# EAGLE schematic flycopter_v1 (EAGLE 9.6.2)

## Sheet 1 of 4: PMS
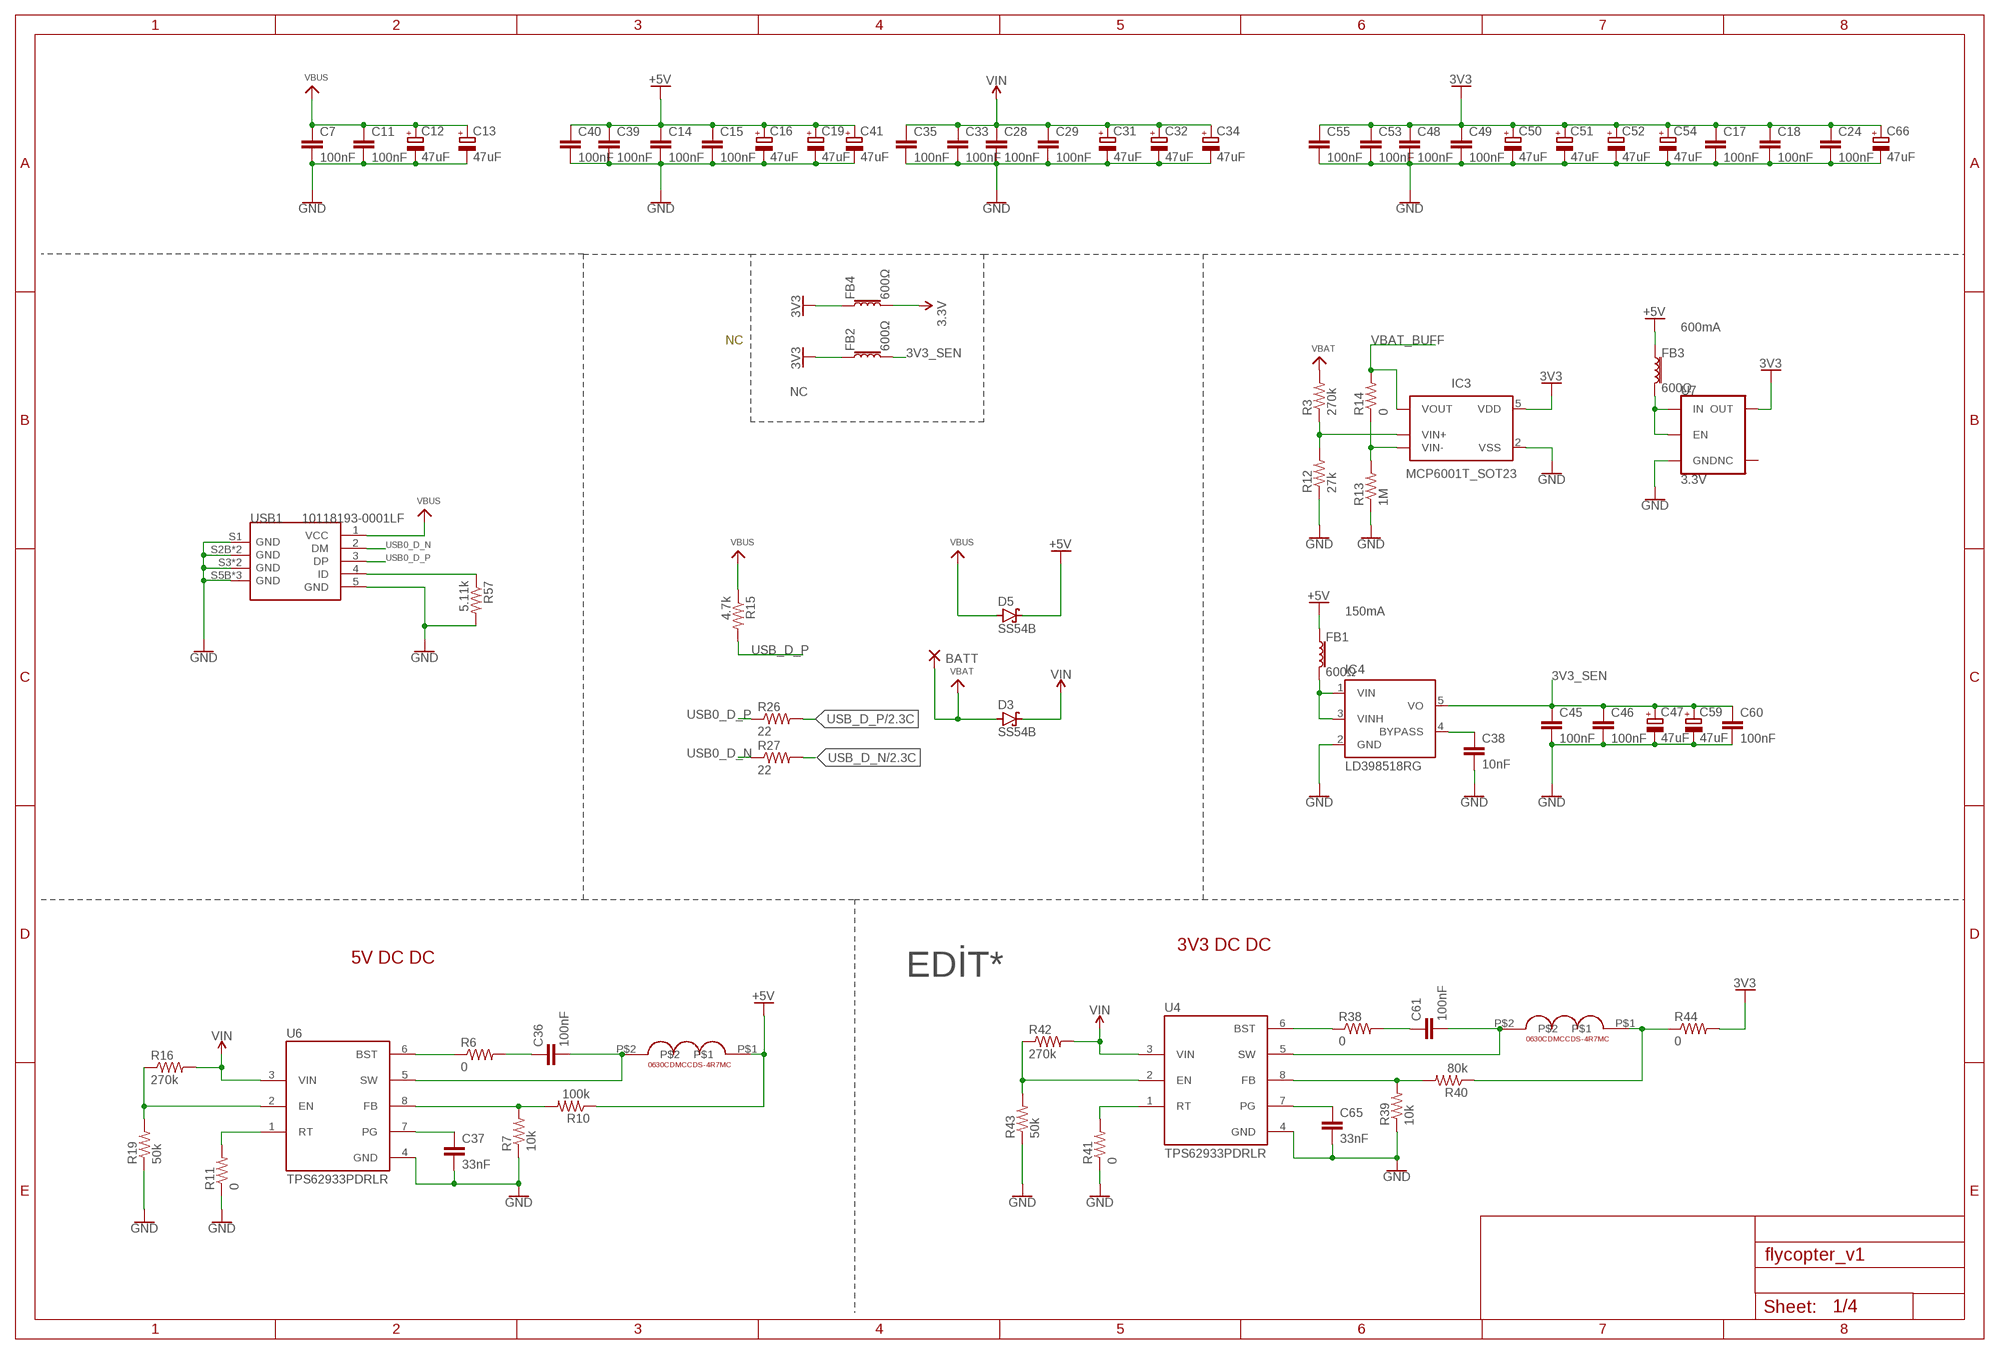
[diagram p0: schematic, sheet 1]

### Parts
BATT  SMD5  [SMD2,54-5,08]
C7  100nF  C-EUC0603K  [C0603K]
C11  100nF  C-EUC0603K  [C0603K]
C12  47uF  CPOL-EUA/3216-18R  [A/3216-18R]
C13  47uF  CPOL-EUA/3216-18R  [A/3216-18R]
C14  100nF  C-EUC0603K  [C0603K]
C15  100nF  C-EUC0603K  [C0603K]
C16  47uF  CPOL-EUA/3216-18R  [A/3216-18R]
C17  100nF  C-EUC0603K  [C0603K]
C18  100nF  C-EUC0603K  [C0603K]
C19  47uF  CPOL-EUA/3216-18R  [A/3216-18R]
C24  100nF  C-EUC0603K  [C0603K]
C28  100nF  C-EUC0603K  [C0603K]
C29  100nF  C-EUC0603K  [C0603K]
C31  47uF  CPOL-EUA/3216-18R  [A/3216-18R]
C32  47uF  CPOL-EUA/3216-18R  [A/3216-18R]
C33  100nF  C-EUC0603K  [C0603K]
C34  47uF  CPOL-EUA/3216-18R  [A/3216-18R]
C35  100nF  C-EUC0603K  [C0603K]
C36  100nF  C-EUC0603K  [C0603K]
C37  33nF  C-EUC0603K  [C0603K]
C38  10nF  C-EUC0603K  [C0603K]
C39  100nF  C-EUC0603K  [C0603K]
C40  100nF  C-EUC0603K  [C0603K]
C41  47uF  CPOL-EUA/3216-18R  [A/3216-18R]
C45  100nF  C-EUC0603K  [C0603K]
C46  100nF  C-EUC0603K  [C0603K]
C47  47uF  CPOL-EUA/3216-18R  [A/3216-18R]
C48  100nF  C-EUC0603K  [C0603K]
C49  100nF  C-EUC0603K  [C0603K]
C50  47uF  CPOL-EUA/3216-18R  [A/3216-18R]
C51  47uF  CPOL-EUA/3216-18R  [A/3216-18R]
C52  47uF  CPOL-EUA/3216-18R  [A/3216-18R]
C53  100nF  C-EUC0603K  [C0603K]
C54  47uF  CPOL-EUA/3216-18R  [A/3216-18R]
C55  100nF  C-EUC0603K  [C0603K]
C59  47uF  CPOL-EUA/3216-18R  [A/3216-18R]
C60  100nF  C-EUC0603K  [C0603K]
C61  100nF  C-EUC0603K  [C0603K]
C65  33nF  C-EUC0603K  [C0603K]
C66  47uF  CPOL-EUA/3216-18R  [A/3216-18R]
D3  SS54B  [SMB]
D5  SS54B  [SMB]
FB1  600Ω  FERRITE_BEAD-0805-600Ω-100MHZ  [0805]
FB2  600Ω  FERRITE_BEAD-0805-600Ω-100MHZ  [0805]
FB3  600Ω  FERRITE_BEAD-0805-600Ω-100MHZ  [0805]
FB4  600Ω  FERRITE_BEAD-0805-600Ω-100MHZ  [0805]
IC3  MCP6001T_SOT23  [SOT95P280X145-5N]
IC4  LD398518RG  [TSOT23-5L]
R3  270k  R-US_R0402  [R0402]
R6  0  R-US_R0402  [R0402]
R7  10k  R-US_R0402  [R0402]
R10  100k  R-US_R0402  [R0402]
R11  0  R-US_R0402  [R0402]
R12  27k  R-US_R0402  [R0402]
R13  1M  R-US_R0402  [R0402]
R14  0  R-US_R0402  [R0402]
R15  4.7k  R-US_R0402  [R0402]
R16  270k  R-US_R0402  [R0402]
R19  50k  R-US_R0402  [R0402]
R26  22  R-US_R0402  [R0402]
R27  22  R-US_R0402  [R0402]
R38  0  R-US_R0402  [R0402]
R39  10k  R-US_R0402  [R0402]
R40  80k  R-US_R0402  [R0402]
R41  0  R-US_R0402  [R0402]
R42  270k  R-US_R0402  [R0402]
R43  50k  R-US_R0402  [R0402]
R44  0  R-US_M0805  [M0805]
R57  5.11k  R-US_R0402  [R0402]
U4  TPS62933PDRLR  [SOFL50P160X60-8N]
U6  TPS62933PDRLR  [SOFL50P160X60-8N]
U7  3.3V  V_REG_AP2112K-3.3V  [SOT23-5]
U$5  6.8uH  0630CDMCCDS-4R7MC  [0630CDMCCDS-4R7MC]
U$9  4.7uH  0630CDMCCDS-4R7MC  [0630CDMCCDS-4R7MC]
USB1  10118193-0001LF  MICRO-USB-SMD-B-(10118193-0001LF)  [MICRO-USB5+6P-SMD-0.65-B]

### Nets
3.3V [power]: FB4.2 ; also sheet 4
3V3 [power]: C17.1 C18.1 C24.1 C48.1 C49.1 C50.+ C51.+ C52.+ C53.1 C54.+ C55.1 C66.+ FB2.1 FB4.1 IC3.5(VDD) R44.2 U7.5(OUT) ; also sheet 2,3
3V3_SEN [power]: C45.1 C46.1 C47.+ C59.+ C60.1 FB2.2 IC4.5(VO) ; also sheet 3
+5V [power]: C14.1 C15.1 C16.+ C19.+ C39.1 C40.1 C41.+ D5.C FB1.1 FB3.1 R10.1 U$5.P$1 ; also sheet 3
GND [power]: C7.2 C11.2 C12.- C13.- C14.2 C15.2 C16.- C17.2 C18.2 C19.- C24.2 C28.2 C29.2 C31.- C32.- C33.2 C34.- C35.2 C37.2 C38.2 C39.2 C40.2 C41.- C45.2 C46.2 C47.- C48.2 C49.2 C50.- C51.- C52.- C53.2 C54.- C55.2 C59.- C60.2 C65.2 C66.- IC3.2(VSS) IC4.2(GND) R7.1 R11.1 R12.1 R13.1 R19.1 R39.1 R41.1 R43.1 R57.2 U4.4(GND) U6.4(GND) U7.2(GND) USB1.5(GND) USB1.S1(GND) USB1.S2B(GND) USB1.S2T(GND) USB1.S3(GND) USB1.S4(GND) USB1.S5B(GND) USB1.S5T(GND) USB1.S6(GND) ; also sheet 2,3,4
N$1: C36.2 U6.5(SW) U$5.P$2
N$4: C36.1 R6.2
N$5: R6.1 U6.6(BST)
N$6: R7.2 R10.2 U6.8(FB)
N$7: C37.1 U6.7(PG)
N$8: R16.1 R19.2 U6.2(EN)
N$9: R11.2 U6.1(RT)
N$10: FB1.2 IC4.1(VIN) IC4.3(VINH)
N$11: C38.1 IC4.4(BYPASS)
N$12: FB3.2 U7.1(IN) U7.3(EN)
N$13: IC3.4(VIN-) R13.2 R14.1
N$14: IC3.3(VIN+) R3.1 R12.2
N$15: C61.2 U4.5(SW) U$9.P$2
N$18: R57.1 USB1.4(ID)
N$52: C61.1 R38.2
N$54: R38.1 U4.6(BST)
N$57: R39.2 R40.2 U4.8(FB)
N$63: C65.1 U4.7(PG)
N$64: R41.2 U4.1(RT)
N$65: R42.1 R43.2 U4.2(EN)
N$66: R40.1 R44.1 U$9.P$1
USB0_D_N [USB]: R27.1 USB1.2(DM)
USB0_D_P [USB]: R26.1 USB1.3(DP)
USB_D_N [USB]: R27.2 ; also sheet 2
USB_D_P [USB]: R15.2 R26.2 ; also sheet 2
VBAT [power]: BATT.1(P) D3.A R3.2
VBAT_BUFF: IC3.1(VOUT) R14.2 ; also sheet 2
VBUS: C7.1 C11.1 C12.+ C13.+ D5.A R15.1 USB1.1(VCC)
VIN [power]: C28.1 C29.1 C31.+ C32.+ C33.1 C34.+ C35.1 D3.C R16.2 R42.2 U4.3(VIN) U6.3(VIN)
Unconnected: U7.4(NC)

### Notes on the sheet
- 600mA
- NC
- NC
- 150mA
- 3V3 DC DC
- 5V DC DC
- EDİT*

## Sheet 2 of 4: MCU
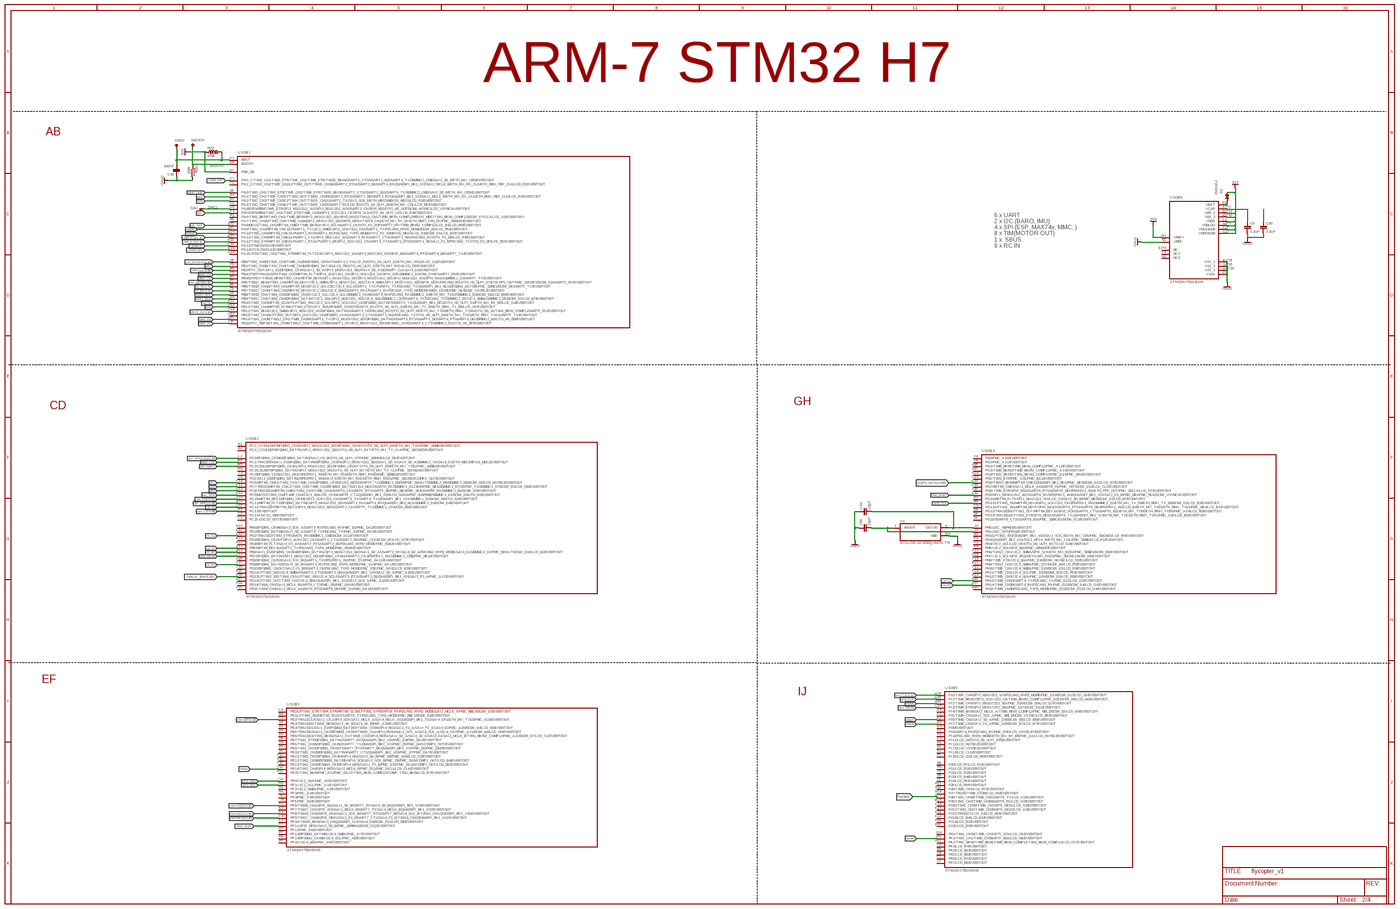
[diagram p1: schematic, sheet 2, overview]
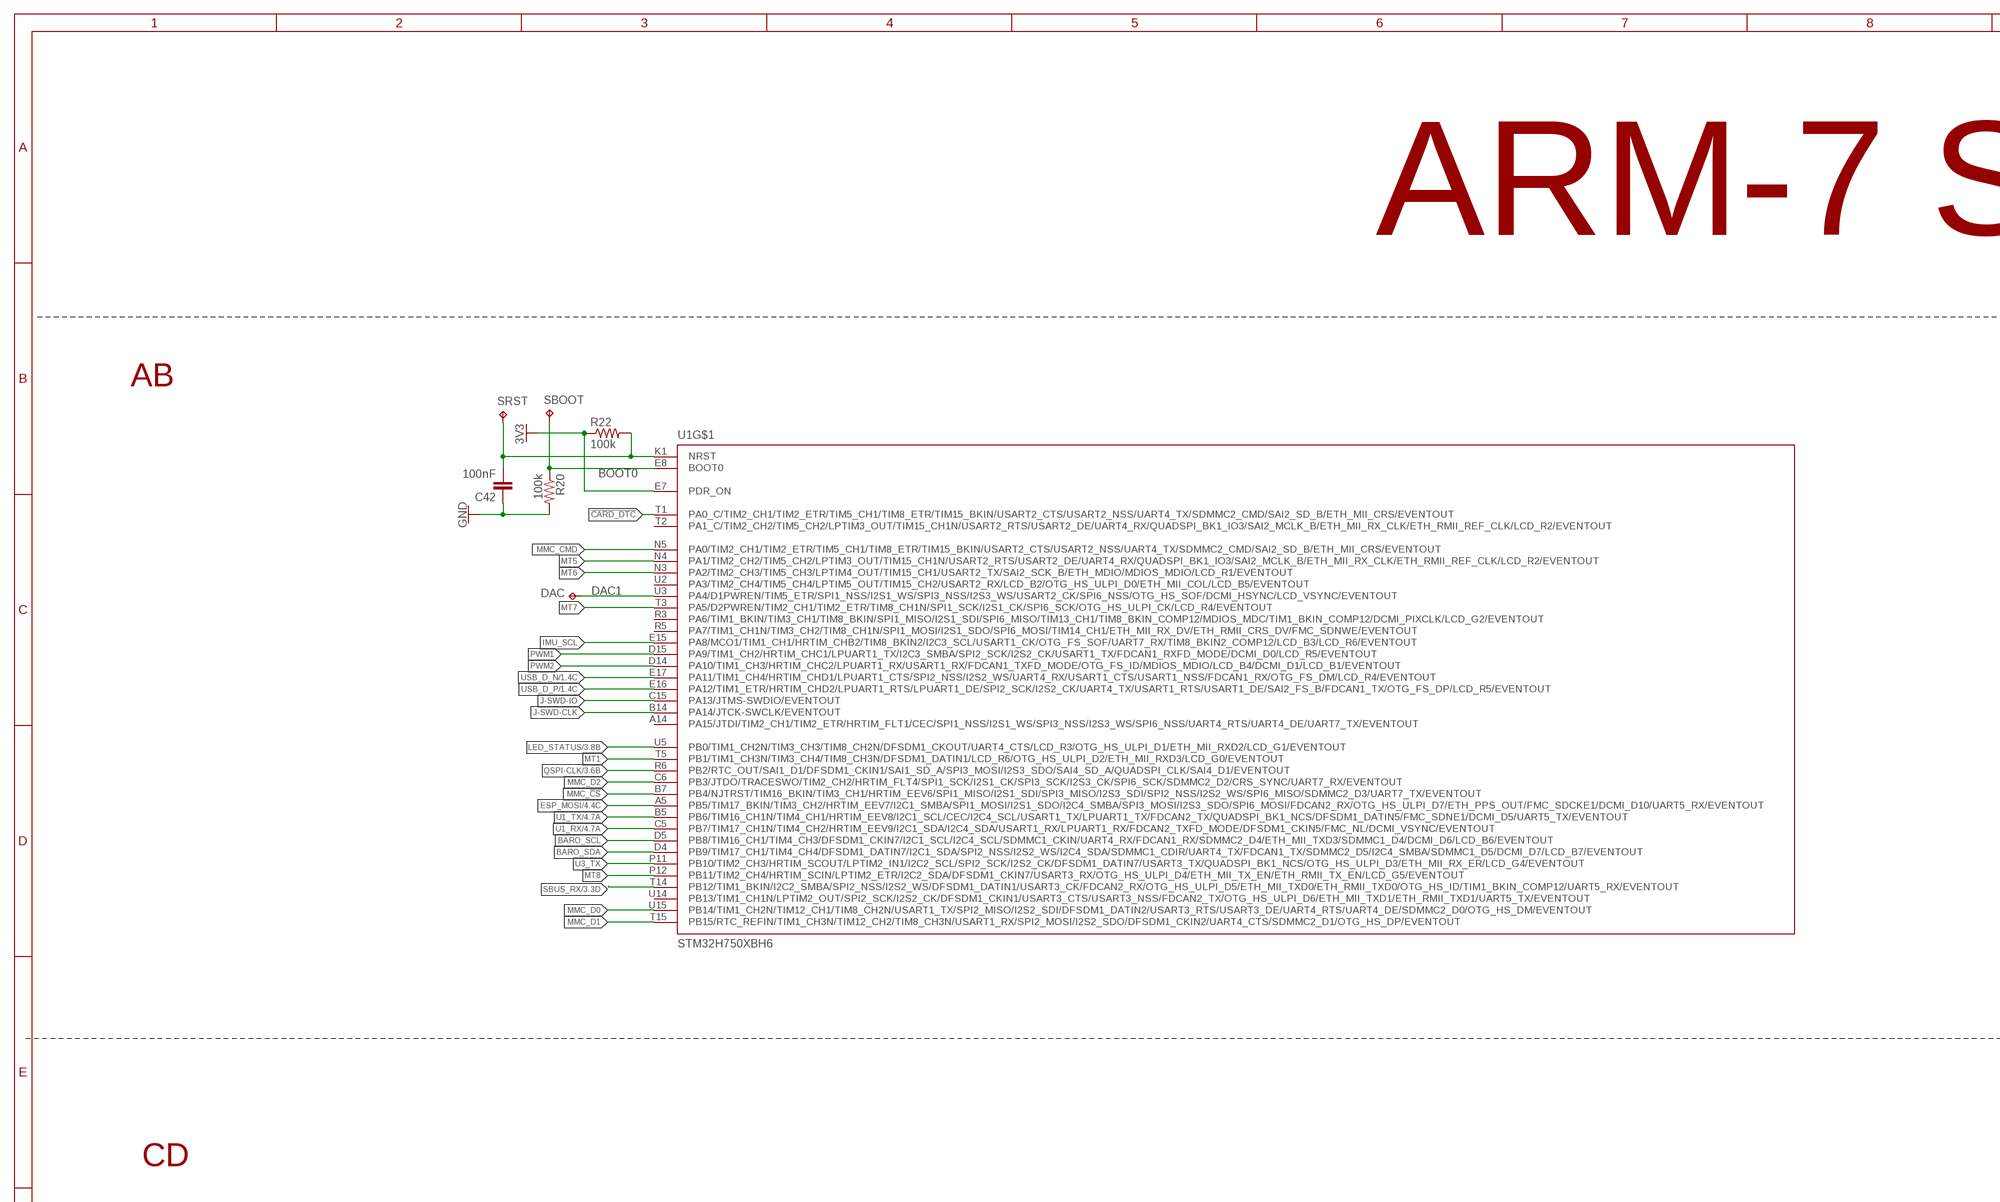
[diagram p2: schematic, sheet 2, part 1 of 4]
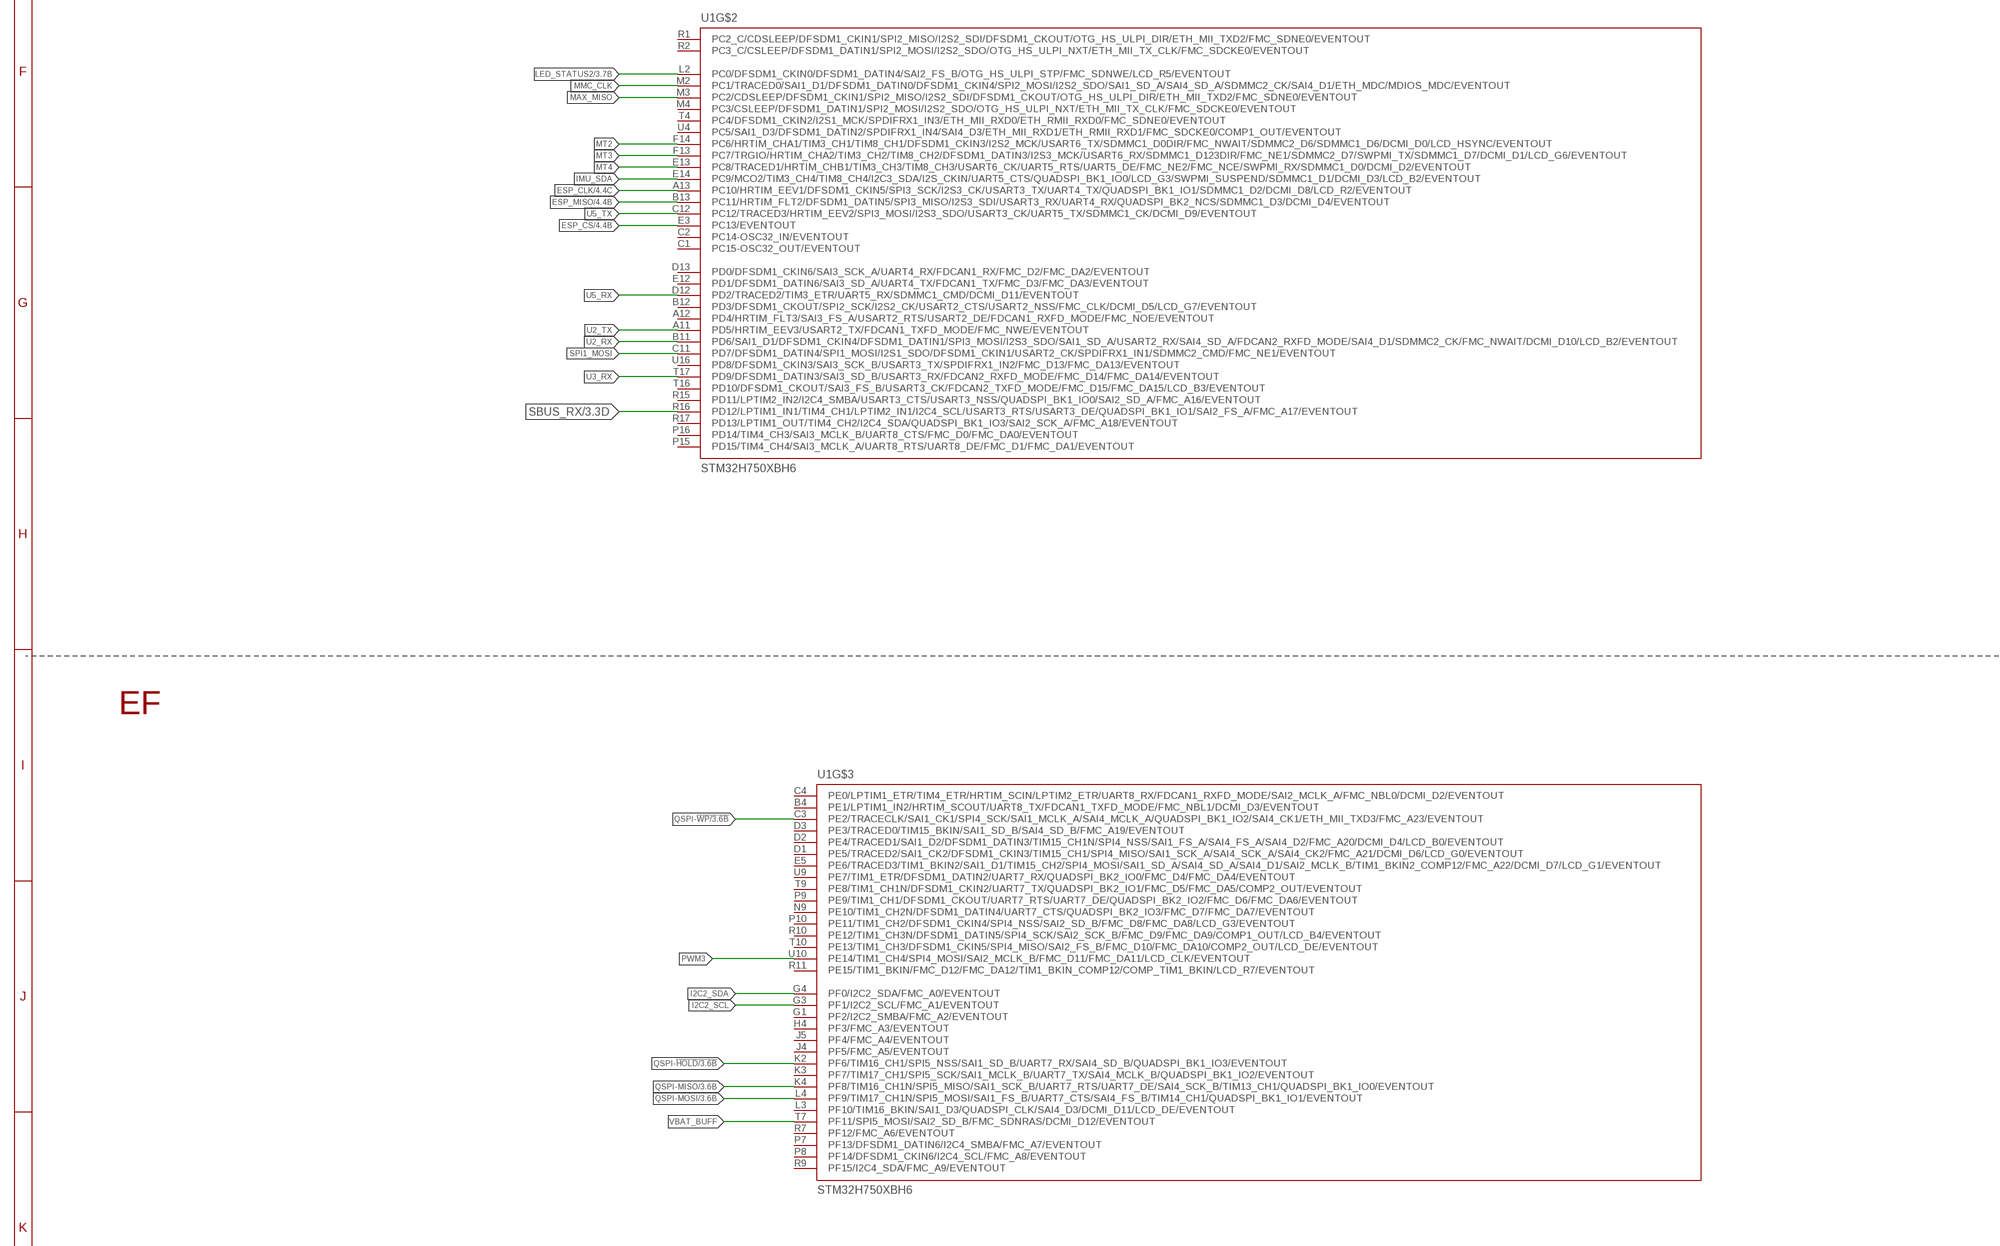
[diagram p3: schematic, sheet 2, part 2 of 4]
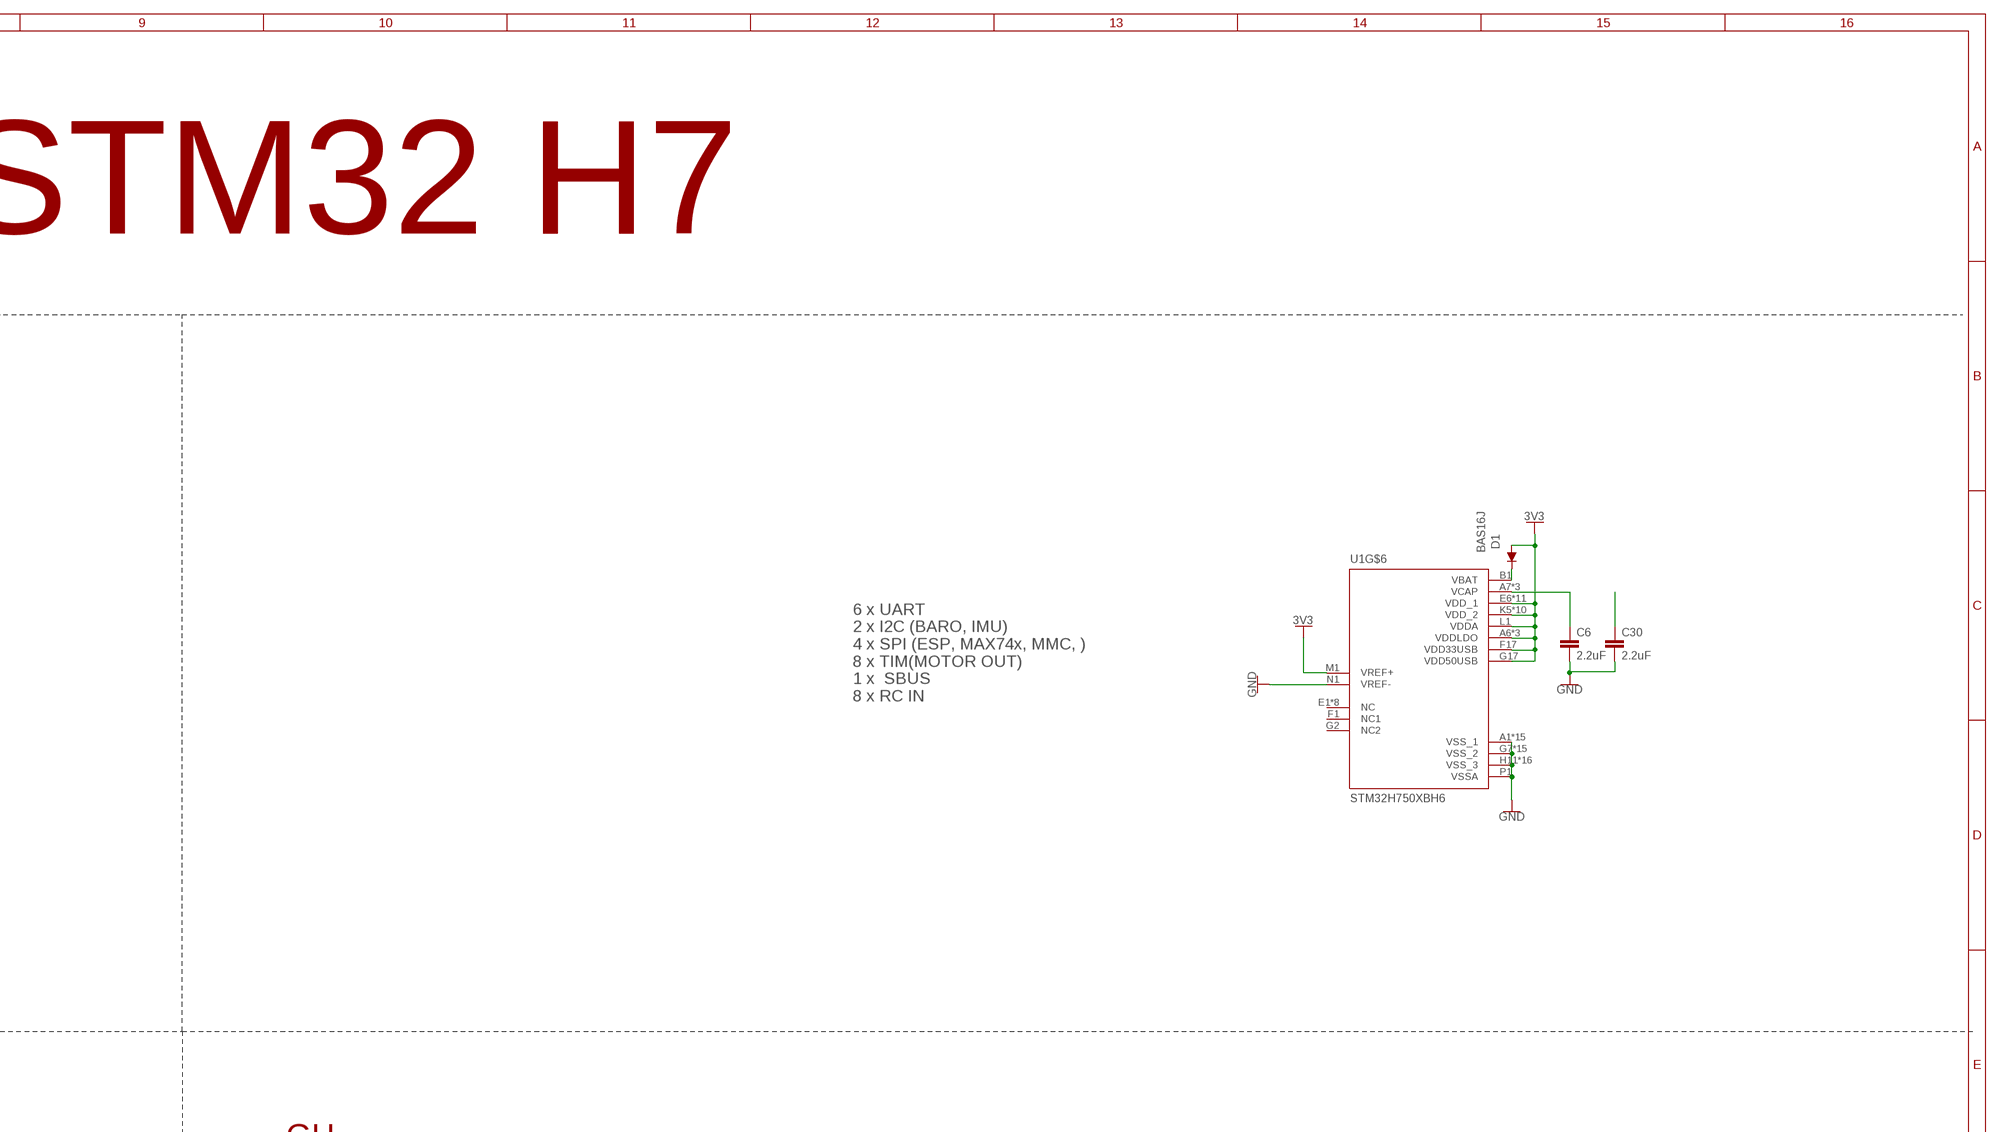
[diagram p4: schematic, sheet 2, part 3 of 4]
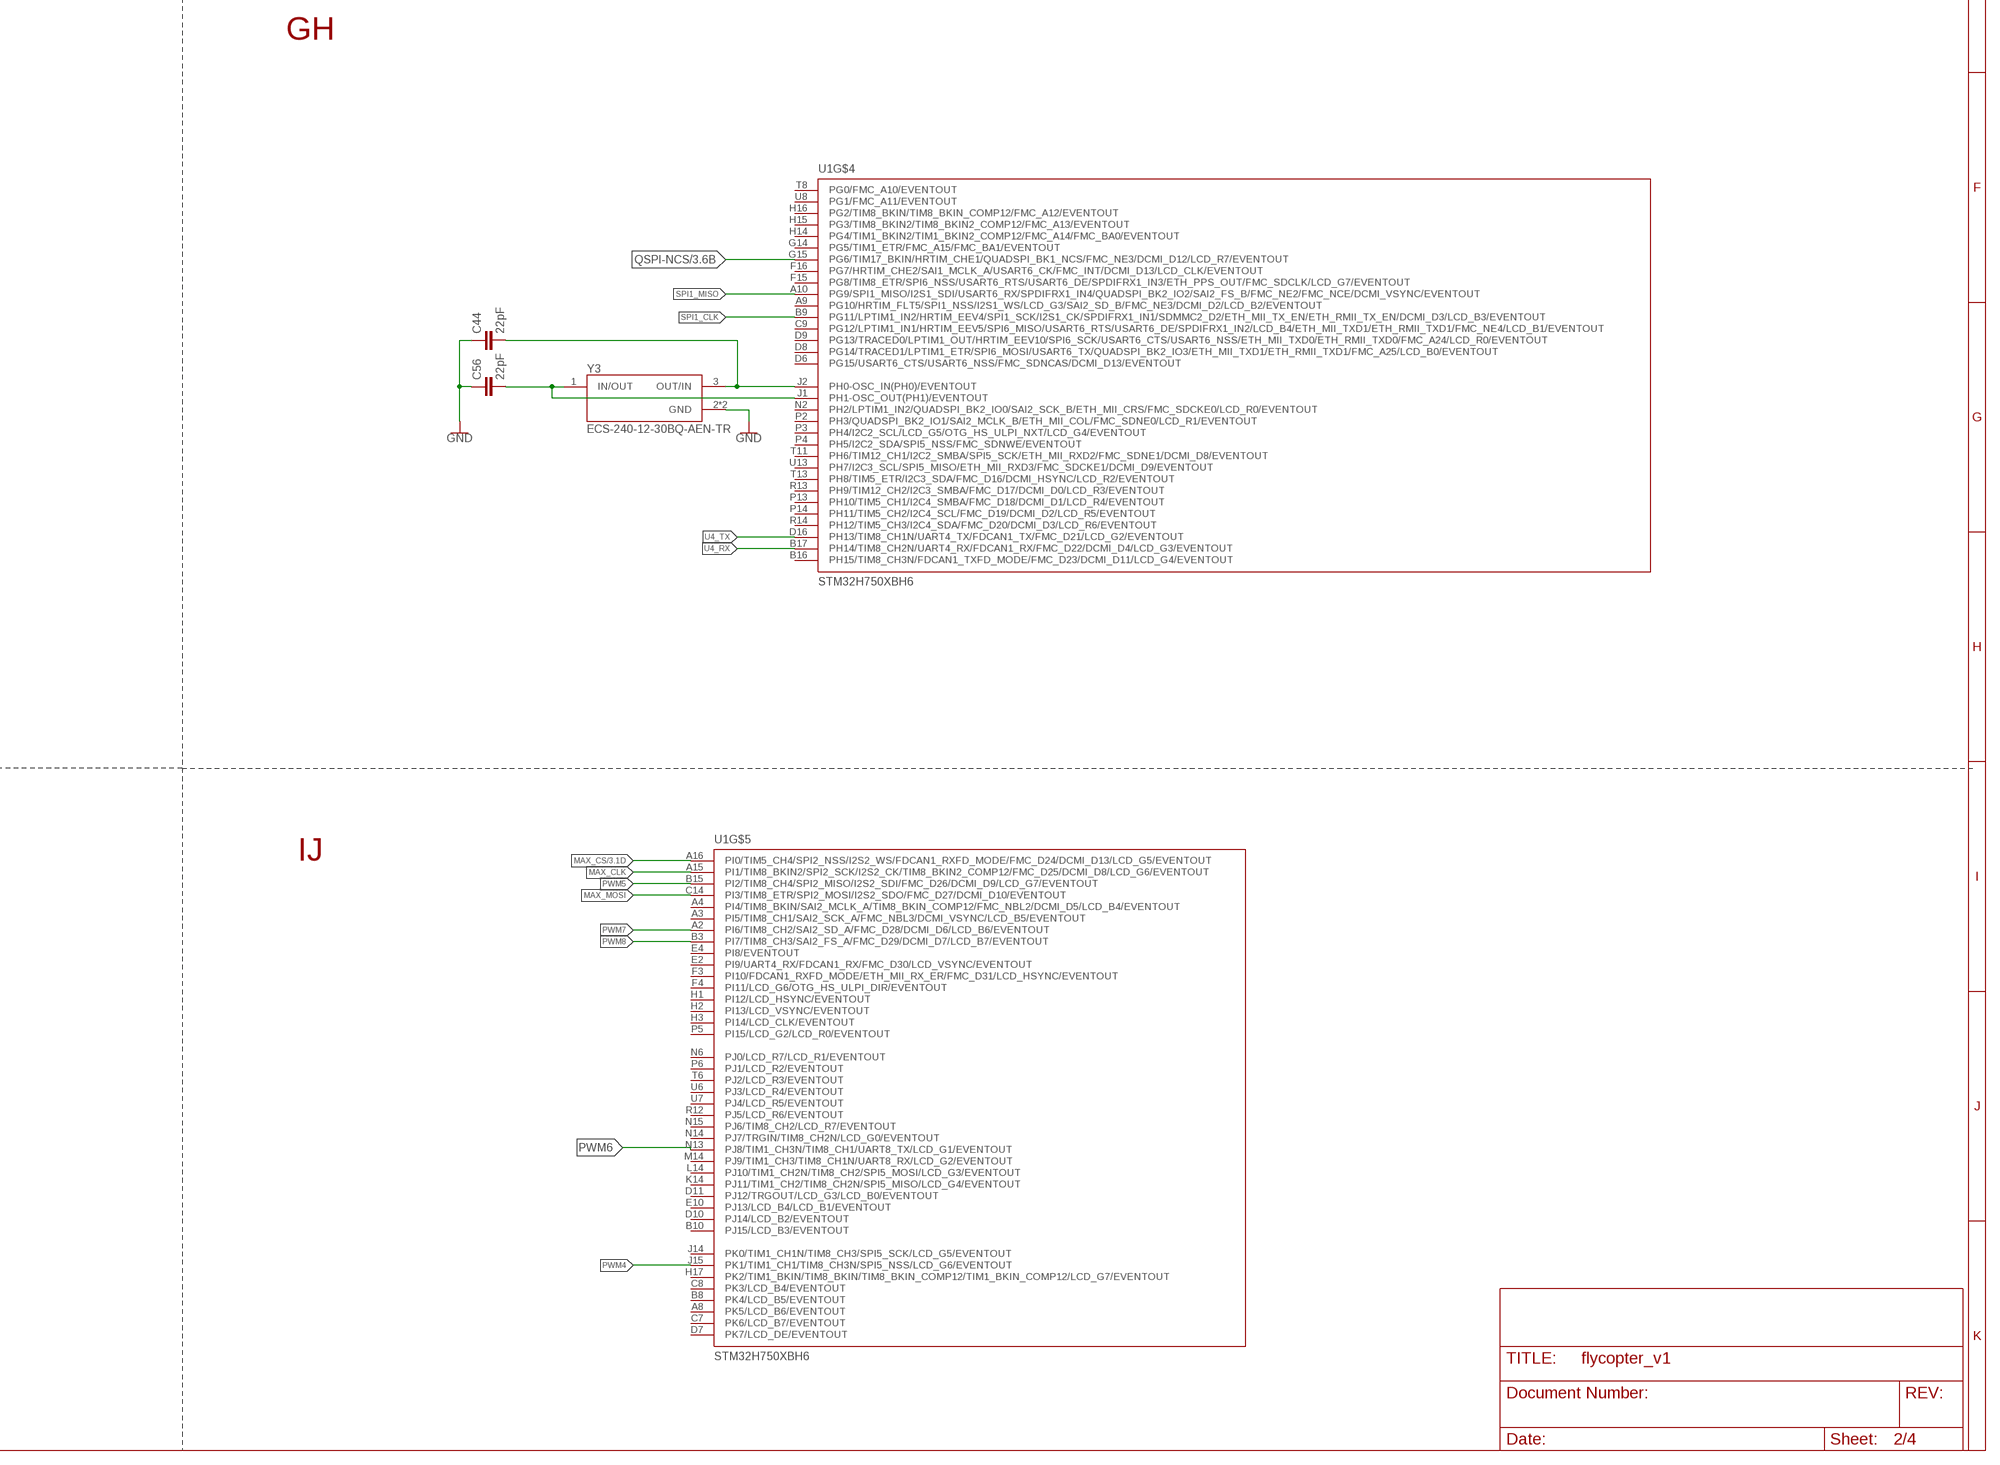
[diagram p5: schematic, sheet 2, part 4 of 4]

### Parts
C6  2.2uF  C-EUC0603K  [C0603K]
C30  2.2uF  C-EUC0603K  [C0603K]
C42  100nF  C-EUC0603K  [C0603K]
C44  22pF  C-EUC0402K  [C0402K]
C56  22pF  C-EUC0402K  [C0402K]
D1  BAS16J  DIODE_DIODE-SOD123  [DIODE_SOD123]
DAC  TPTP06R  [TP06R]
R20  100k  R-US_R0402  [R0402]
R22  100k  R-US_R0402  [R0402]
SBOOT  TPTP06R  [TP06R]
SRST  TPTP06R  [TP06R]
U1  STM32H750XBH6  [IC_STM32H750XBH6]
Y3  ECS-240-12-30BQ-AEN-TR  [XTAL_ECS-240-12-30BQ-AEN-TR]

### Nets
3V3 [power]: D1.A R22.1 U1.A6(VDDLDO) U1.C17(VDDLDO) U1.E6(VDD_1) U1.E7(PDR_ON) U1.E9(VDD_1) U1.E11(VDD_1) U1.F5(VDD_1) U1.F17(VDD33USB) U1.G5(VDD_1) U1.G13(VDD_1) U1.G17(VDD50USB) U1.H5(VDD_1) U1.H13(VDD_1) U1.J13(VDD_1) U1.K5(VDD_2) U1.K13(VDD_1) U1.L1(VDDA) U1.L5(VDD_2) U1.L13(VDD_1) U1.M1(VREF+) U1.M5(VDD_2) U1.M13(VDD_2) U1.N7(VDD_2) U1.N8(VDD_2) U1.N10(VDD_2) U1.N11(VDD_2) U1.N12(VDD_2) U1.P17(VDD_2) U1.U12(VDDLDO) ; also sheet 1,3
!CARD_DTC: U1.T1(PA0_C/TIM2_CH1/TIM2_ETR/TIM5_CH1/TIM8_ETR/TIM15_BKIN/USART2_CTS/USART2_NSS/UART4_TX/SDMMC2_CMD/SAI2_SD_B/ETH_MII_CRS/EVENTOUT) ; also sheet 3
BARO_SCL: U1.D5(PB8/TIM16_CH1/TIM4_CH3/DFSDM1_CKIN7/I2C1_SCL/I2C4_SCL/SDMMC1_CKIN/UART4_RX/FDCAN1_RX/SDMMC2_D4/ETH_MII_TXD3/SDMMC1_D4/DCMI_D6/LCD_B6/EVENTOUT) ; also sheet 3
BARO_SDA: U1.D4(PB9/TIM17_CH1/TIM4_CH4/DFSDM1_DATIN7/I2C1_SDA/SPI2_NSS/I2S2_WS/I2C4_SDA/SDMMC1_CDIR/UART4_TX/FDCAN1_TX/SDMMC2_D5/I2C4_SMBA/SDMMC1_D5/DCMI_D7/LCD_B7/EVENTOUT) ; also sheet 3
BOOT0: R20.1 SBOOT.TP U1.E8(BOOT0)
DAC1: DAC.TP U1.U3(PA4/D1PWREN/TIM5_ETR/SPI1_NSS/I2S1_WS/SPI3_NSS/I2S3_WS/USART2_CK/SPI6_NSS/OTG_HS_SOF/DCMI_HSYNC/LCD_VSYNC/EVENTOUT)
ESP_CLK: U1.A13(PC10/HRTIM_EEV1/DFSDM1_CKIN5/SPI3_SCK/I2S3_CK/USART3_TX/UART4_TX/QUADSPI_BK1_IO1/SDMMC1_D2/DCMI_D8/LCD_R2/EVENTOUT) ; also sheet 4
ESP_CS: U1.E3(PC13/EVENTOUT) ; also sheet 4
ESP_MISO: U1.B13(PC11/HRTIM_FLT2/DFSDM1_DATIN5/SPI3_MISO/I2S3_SDI/USART3_RX/UART4_RX/QUADSPI_BK2_NCS/SDMMC1_D3/DCMI_D4/EVENTOUT) ; also sheet 4
ESP_MOSI: U1.A5(PB5/TIM17_BKIN/TIM3_CH2/HRTIM_EEV7/I2C1_SMBA/SPI1_MOSI/I2S1_SDO/I2C4_SMBA/SPI3_MOSI/I2S3_SDO/SPI6_MOSI/FDCAN2_RX/OTG_HS_ULPI_D7/ETH_PPS_OUT/FMC_SDCKE1/DCMI_D10/UART5_RX/EVENTOUT) ; also sheet 4
GND [power]: C6.2 C30.2 C42.1 C44.1 C56.1 R20.2 U1.A1(VSS_1) U1.A17(VSS_1) U1.B2(VSS_1) U1.B6(VSS_1) U1.C10(VSS_1) U1.C13(VSS_1) U1.C16(VSS_1) U1.F2(VSS_1) U1.G7(VSS_2) U1.G8(VSS_2) U1.G9(VSS_2) U1.G10(VSS_2) U1.G11(VSS_2) U1.G16(VSS_2) U1.H7(VSS_2) U1.H8(VSS_2) U1.H9(VSS_2) U1.H10(VSS_2) U1.H11(VSS_3) U1.J3(VSS_1) U1.J7(VSS_3) U1.J8(VSS_3) U1.J9(VSS_3) U1.J10(VSS_3) U1.J11(VSS_3) U1.J16(VSS_1) U1.J17(VSS_1) U1.K7(VSS_3) U1.K8(VSS_3) U1.K9(VSS_3) U1.K10(VSS_3) U1.K11(VSS_3) U1.K15(VSS_2) U1.L7(VSS_3) U1.L8(VSS_3) U1.L9(VSS_3) U1.L10(VSS_3) U1.L11(VSS_3) U1.L15(VSS_2) U1.M15(VSS_2) U1.N1(VREF-) U1.N16(VSS_1) U1.P1(VSSA) U1.R4(VSS_1) U1.R8(VSS_2) U1.T12(VSS_1) U1.U1(VSS_2) U1.U17(VSS_1) Y3.2(GND) Y3.4(GND) ; also sheet 1,3,4
I2C2_SCL: U1.G3(PF1/I2C2_SCL/FMC_A1/EVENTOUT) ; also sheet 3
I2C2_SDA: U1.G4(PF0/I2C2_SDA/FMC_A0/EVENTOUT) ; also sheet 3
IMU_SCL: U1.E15(PA8/MCO1/TIM1_CH1/HRTIM_CHB2/TIM8_BKIN2/I2C3_SCL/USART1_CK/OTG_FS_SOF/UART7_RX/TIM8_BKIN2_COMP12/LCD_B3/LCD_R6/EVENTOUT) ; also sheet 3
IMU_SDA: U1.E14(PC9/MCO2/TIM3_CH4/TIM8_CH4/I2C3_SDA/I2S_CKIN/UART5_CTS/QUADSPI_BK1_IO0/LCD_G3/SWPMI_SUSPEND/SDMMC1_D1/DCMI_D3/LCD_B2/EVENTOUT) ; also sheet 3
J-SWD-CLK: U1.B14(PA14/JTCK-SWCLK/EVENTOUT) ; also sheet 3
J-SWD-IO: U1.C15(PA13/JTMS-SWDIO/EVENTOUT) ; also sheet 3
LED_STATUS: U1.U5(PB0/TIM1_CH2N/TIM3_CH3/TIM8_CH2N/DFSDM1_CKOUT/UART4_CTS/LCD_R3/OTG_HS_ULPI_D1/ETH_MII_RXD2/LCD_G1/EVENTOUT) ; also sheet 3
LED_STATUS2: U1.L2(PC0/DFSDM1_CKIN0/DFSDM1_DATIN4/SAI2_FS_B/OTG_HS_ULPI_STP/FMC_SDNWE/LCD_R5/EVENTOUT) ; also sheet 3
MAX_CLK: U1.A15(PI1/TIM8_BKIN2/SPI2_SCK/I2S2_CK/TIM8_BKIN2_COMP12/FMC_D25/DCMI_D8/LCD_G6/EVENTOUT) ; also sheet 3
MAX_CS: U1.A16(PI0/TIM5_CH4/SPI2_NSS/I2S2_WS/FDCAN1_RXFD_MODE/FMC_D24/DCMI_D13/LCD_G5/EVENTOUT) ; also sheet 3
MAX_MISO: U1.M3(PC2/CDSLEEP/DFSDM1_CKIN1/SPI2_MISO/I2S2_SDI/DFSDM1_CKOUT/OTG_HS_ULPI_DIR/ETH_MII_TXD2/FMC_SDNE0/EVENTOUT) ; also sheet 3
MAX_MOSI: U1.C14(PI3/TIM8_ETR/SPI2_MOSI/I2S2_SDO/FMC_D27/DCMI_D10/EVENTOUT) ; also sheet 3
MMC_!CS: U1.B7(PB4/NJTRST/TIM16_BKIN/TIM3_CH1/HRTIM_EEV6/SPI1_MISO/I2S1_SDI/SPI3_MISO/I2S3_SDI/SPI2_NSS/I2S2_WS/SPI6_MISO/SDMMC2_D3/UART7_TX/EVENTOUT) ; also sheet 3
MMC_CLK: U1.M2(PC1/TRACED0/SAI1_D1/DFSDM1_DATIN0/DFSDM1_CKIN4/SPI2_MOSI/I2S2_SDO/SAI1_SD_A/SAI4_SD_A/SDMMC2_CK/SAI4_D1/ETH_MDC/MDIOS_MDC/EVENTOUT) ; also sheet 3
MMC_CMD: U1.N5(PA0/TIM2_CH1/TIM2_ETR/TIM5_CH1/TIM8_ETR/TIM15_BKIN/USART2_CTS/USART2_NSS/UART4_TX/SDMMC2_CMD/SAI2_SD_B/ETH_MII_CRS/EVENTOUT) ; also sheet 3
MMC_D0: U1.U15(PB14/TIM1_CH2N/TIM12_CH1/TIM8_CH2N/USART1_TX/SPI2_MISO/I2S2_SDI/DFSDM1_DATIN2/USART3_RTS/USART3_DE/UART4_RTS/UART4_DE/SDMMC2_D0/OTG_HS_DM/EVENTOUT) ; also sheet 3
MMC_D1: U1.T15(PB15/RTC_REFIN/TIM1_CH3N/TIM12_CH2/TIM8_CH3N/USART1_RX/SPI2_MOSI/I2S2_SDO/DFSDM1_CKIN2/UART4_CTS/SDMMC2_D1/OTG_HS_DP/EVENTOUT) ; also sheet 3
MMC_D2: U1.C6(PB3/JTDO/TRACESWO/TIM2_CH2/HRTIM_FLT4/SPI1_SCK/I2S1_CK/SPI3_SCK/I2S3_CK/SPI6_SCK/SDMMC2_D2/CRS_SYNC/UART7_RX/EVENTOUT) ; also sheet 3
MT1: U1.T5(PB1/TIM1_CH3N/TIM3_CH4/TIM8_CH3N/DFSDM1_DATIN1/LCD_R6/OTG_HS_ULPI_D2/ETH_MII_RXD3/LCD_G0/EVENTOUT) ; also sheet 3
MT2: U1.F14(PC6/HRTIM_CHA1/TIM3_CH1/TIM8_CH1/DFSDM1_CKIN3/I2S2_MCK/USART6_TX/SDMMC1_D0DIR/FMC_NWAIT/SDMMC2_D6/SDMMC1_D6/DCMI_D0/LCD_HSYNC/EVENTOUT) ; also sheet 3
MT3: U1.F13(PC7/TRGIO/HRTIM_CHA2/TIM3_CH2/TIM8_CH2/DFSDM1_DATIN3/I2S3_MCK/USART6_RX/SDMMC1_D123DIR/FMC_NE1/SDMMC2_D7/SWPMI_TX/SDMMC1_D7/DCMI_D1/LCD_G6/EVENTOUT) ; also sheet 3
MT4: U1.E13(PC8/TRACED1/HRTIM_CHB1/TIM3_CH3/TIM8_CH3/USART6_CK/UART5_RTS/UART5_DE/FMC_NE2/FMC_NCE/SWPMI_RX/SDMMC1_D0/DCMI_D2/EVENTOUT) ; also sheet 3
MT5: U1.N4(PA1/TIM2_CH2/TIM5_CH2/LPTIM3_OUT/TIM15_CH1N/USART2_RTS/USART2_DE/UART4_RX/QUADSPI_BK1_IO3/SAI2_MCLK_B/ETH_MII_RX_CLK/ETH_RMII_REF_CLK/LCD_R2/EVENTOUT) ; also sheet 3
MT6: U1.N3(PA2/TIM2_CH3/TIM5_CH3/LPTIM4_OUT/TIM15_CH1/USART2_TX/SAI2_SCK_B/ETH_MDIO/MDIOS_MDIO/LCD_R1/EVENTOUT) ; also sheet 3
MT7: U1.T3(PA5/D2PWREN/TIM2_CH1/TIM2_ETR/TIM8_CH1N/SPI1_SCK/I2S1_CK/SPI6_SCK/OTG_HS_ULPI_CK/LCD_R4/EVENTOUT) ; also sheet 3
MT8: U1.P12(PB11/TIM2_CH4/HRTIM_SCIN/LPTIM2_ETR/I2C2_SDA/DFSDM1_CKIN7/USART3_RX/OTG_HS_ULPI_D4/ETH_MII_TX_EN/ETH_RMII_TX_EN/LCD_G5/EVENTOUT) ; also sheet 3
N$3: C30.1
N$16: C42.2 R22.2 SRST.TP U1.K1(NRST)
N$19: D1.C U1.B1(VBAT)
N$20: C6.1 U1.A7(VCAP) U1.D17(VCAP) U1.U11(VCAP)
N$21: C44.2 U1.J2(PH0-OSC_IN(PH0)/EVENTOUT) Y3.3(OUT/IN)
N$22: C56.2 U1.J1(PH1-OSC_OUT(PH1)/EVENTOUT) Y3.1(IN/OUT)
PWM1: U1.D15(PA9/TIM1_CH2/HRTIM_CHC1/LPUART1_TX/I2C3_SMBA/SPI2_SCK/I2S2_CK/USART1_TX/FDCAN1_RXFD_MODE/DCMI_D0/LCD_R5/EVENTOUT) ; also sheet 3
PWM2: U1.D14(PA10/TIM1_CH3/HRTIM_CHC2/LPUART1_RX/USART1_RX/FDCAN1_TXFD_MODE/OTG_FS_ID/MDIOS_MDIO/LCD_B4/DCMI_D1/LCD_B1/EVENTOUT) ; also sheet 3
PWM3: U1.U10(PE14/TIM1_CH4/SPI4_MOSI/SAI2_MCLK_B/FMC_D11/FMC_DA11/LCD_CLK/EVENTOUT) ; also sheet 3
PWM4: U1.J15(PK1/TIM1_CH1/TIM8_CH3N/SPI5_NSS/LCD_G6/EVENTOUT) ; also sheet 3
PWM5: U1.B15(PI2/TIM8_CH4/SPI2_MISO/I2S2_SDI/FMC_D26/DCMI_D9/LCD_G7/EVENTOUT) ; also sheet 3
PWM6: U1.N13(PJ8/TIM1_CH3N/TIM8_CH1/UART8_TX/LCD_G1/EVENTOUT) ; also sheet 3
PWM7: U1.A2(PI6/TIM8_CH2/SAI2_SD_A/FMC_D28/DCMI_D6/LCD_B6/EVENTOUT) ; also sheet 3
PWM8: U1.B3(PI7/TIM8_CH3/SAI2_FS_A/FMC_D29/DCMI_D7/LCD_B7/EVENTOUT) ; also sheet 3
QSPI-!HOLD: U1.K2(PF6/TIM16_CH1/SPI5_NSS/SAI1_SD_B/UART7_RX/SAI4_SD_B/QUADSPI_BK1_IO3/EVENTOUT) ; also sheet 3
QSPI-!WP: U1.C3(PE2/TRACECLK/SAI1_CK1/SPI4_SCK/SAI1_MCLK_A/SAI4_MCLK_A/QUADSPI_BK1_IO2/SAI4_CK1/ETH_MII_TXD3/FMC_A23/EVENTOUT) ; also sheet 3
QSPI-CLK: U1.R6(PB2/RTC_OUT/SAI1_D1/DFSDM1_CKIN1/SAI1_SD_A/SPI3_MOSI/I2S3_SDO/SAI4_SD_A/QUADSPI_CLK/SAI4_D1/EVENTOUT) ; also sheet 3
QSPI-MISO: U1.K4(PF8/TIM16_CH1N/SPI5_MISO/SAI1_SCK_B/UART7_RTS/UART7_DE/SAI4_SCK_B/TIM13_CH1/QUADSPI_BK1_IO0/EVENTOUT) ; also sheet 3
QSPI-MOSI: U1.L4(PF9/TIM17_CH1N/SPI5_MOSI/SAI1_FS_B/UART7_CTS/SAI4_FS_B/TIM14_CH1/QUADSPI_BK1_IO1/EVENTOUT) ; also sheet 3
QSPI-NCS: U1.G15(PG6/TIM17_BKIN/HRTIM_CHE1/QUADSPI_BK1_NCS/FMC_NE3/DCMI_D12/LCD_R7/EVENTOUT) ; also sheet 3
SBUS_RX: U1.R16(PD12/LPTIM1_IN1/TIM4_CH1/LPTIM2_IN1/I2C4_SCL/USART3_RTS/USART3_DE/QUADSPI_BK1_IO1/SAI2_FS_A/FMC_A17/EVENTOUT) U1.T14(PB12/TIM1_BKIN/I2C2_SMBA/SPI2_NSS/I2S2_WS/DFSDM1_DATIN1/USART3_CK/FDCAN2_RX/OTG_HS_ULPI_D5/ETH_MII_TXD0/ETH_RMII_TXD0/OTG_HS_ID/TIM1_BKIN_COMP12/UART5_RX/EVENTOUT) ; also sheet 3
SPI1_CLK: U1.B9(PG11/LPTIM1_IN2/HRTIM_EEV4/SPI1_SCK/I2S1_CK/SPDIFRX1_IN1/SDMMC2_D2/ETH_MII_TX_EN/ETH_RMII_TX_EN/DCMI_D3/LCD_B3/EVENTOUT)
SPI1_MISO: U1.A10(PG9/SPI1_MISO/I2S1_SDI/USART6_RX/SPDIFRX1_IN4/QUADSPI_BK2_IO2/SAI2_FS_B/FMC_NE2/FMC_NCE/DCMI_VSYNC/EVENTOUT)
SPI1_MOSI: U1.C11(PD7/DFSDM1_DATIN4/SPI1_MOSI/I2S1_SDO/DFSDM1_CKIN1/USART2_CK/SPDIFRX1_IN1/SDMMC2_CMD/FMC_NE1/EVENTOUT)
U1_RX: U1.C5(PB7/TIM17_CH1N/TIM4_CH2/HRTIM_EEV9/I2C1_SDA/I2C4_SDA/USART1_RX/LPUART1_RX/FDCAN2_TXFD_MODE/DFSDM1_CKIN5/FMC_NL/DCMI_VSYNC/EVENTOUT) ; also sheet 3,4
U1_TX: U1.B5(PB6/TIM16_CH1N/TIM4_CH1/HRTIM_EEV8/I2C1_SCL/CEC/I2C4_SCL/USART1_TX/LPUART1_TX/FDCAN2_TX/QUADSPI_BK1_NCS/DFSDM1_DATIN5/FMC_SDNE1/DCMI_D5/UART5_TX/EVENTOUT) ; also sheet 3,4
U2_RX: U1.B11(PD6/SAI1_D1/DFSDM1_CKIN4/DFSDM1_DATIN1/SPI3_MOSI/I2S3_SDO/SAI1_SD_A/USART2_RX/SAI4_SD_A/FDCAN2_RXFD_MODE/SAI4_D1/SDMMC2_CK/FMC_NWAIT/DCMI_D10/LCD_B2/EVENTOUT)
U2_TX: U1.A11(PD5/HRTIM_EEV3/USART2_TX/FDCAN1_TXFD_MODE/FMC_NWE/EVENTOUT)
U3_RX: U1.T17(PD9/DFSDM1_DATIN3/SAI3_SD_B/USART3_RX/FDCAN2_RXFD_MODE/FMC_D14/FMC_DA14/EVENTOUT) ; also sheet 3
U3_TX: U1.P11(PB10/TIM2_CH3/HRTIM_SCOUT/LPTIM2_IN1/I2C2_SCL/SPI2_SCK/I2S2_CK/DFSDM1_DATIN7/USART3_TX/QUADSPI_BK1_NCS/OTG_HS_ULPI_D3/ETH_MII_RX_ER/LCD_G4/EVENTOUT) ; also sheet 3
U4_RX: U1.B17(PH14/TIM8_CH2N/UART4_RX/FDCAN1_RX/FMC_D22/DCMI_D4/LCD_G3/EVENTOUT) ; also sheet 3
U4_TX: U1.D16(PH13/TIM8_CH1N/UART4_TX/FDCAN1_TX/FMC_D21/LCD_G2/EVENTOUT) ; also sheet 3
U5_RX: U1.D12(PD2/TRACED2/TIM3_ETR/UART5_RX/SDMMC1_CMD/DCMI_D11/EVENTOUT) ; also sheet 3
U5_TX: U1.C12(PC12/TRACED3/HRTIM_EEV2/SPI3_MOSI/I2S3_SDO/USART3_CK/UART5_TX/SDMMC1_CK/DCMI_D9/EVENTOUT) ; also sheet 3
USB_D_N [USB]: U1.E17(PA11/TIM1_CH4/HRTIM_CHD1/LPUART1_CTS/SPI2_NSS/I2S2_WS/UART4_RX/USART1_CTS/USART1_NSS/FDCAN1_RX/OTG_FS_DM/LCD_R4/EVENTOUT) ; also sheet 1
USB_D_P [USB]: U1.E16(PA12/TIM1_ETR/HRTIM_CHD2/LPUART1_RTS/LPUART1_DE/SPI2_SCK/I2S2_CK/UART4_TX/USART1_RTS/USART1_DE/SAI2_FS_B/FDCAN1_TX/OTG_FS_DP/LCD_R5/EVENTOUT) ; also sheet 1
VBAT_BUFF: U1.T7(PF11/SPI5_MOSI/SAI2_SD_B/FMC_SDNRAS/DCMI_D12/EVENTOUT) ; also sheet 1
Unconnected: U1.A3(PI5/TIM8_CH1/SAI2_SCK_A/FMC_NBL3/DCMI_VSYNC/LCD_B5/EVENTOUT) U1.A4(PI4/TIM8_BKIN/SAI2_MCLK_A/TIM8_BKIN_COMP12/FMC_NBL2/DCMI_D5/LCD_B4/EVENTOUT) U1.A8(PK5/LCD_B6/EVENTOUT) U1.A9(PG10/HRTIM_FLT5/SPI1_NSS/I2S1_WS/LCD_G3/SAI2_SD_B/FMC_NE3/DCMI_D2/LCD_B2/EVENTOUT) U1.A12(PD4/HRTIM_FLT3/SAI3_FS_A/USART2_RTS/USART2_DE/FDCAN1_RXFD_MODE/FMC_NOE/EVENTOUT) U1.A14(PA15/JTDI/TIM2_CH1/TIM2_ETR/HRTIM_FLT1/CEC/SPI1_NSS/I2S1_WS/SPI3_NSS/I2S3_WS/SPI6_NSS/UART4_RTS/UART4_DE/UART7_TX/EVENTOUT) U1.B4(PE1/LPTIM1_IN2/HRTIM_SCOUT/UART8_TX/FDCAN1_TXFD_MODE/FMC_NBL1/DCMI_D3/EVENTOUT) U1.B8(PK4/LCD_B5/EVENTOUT) U1.B10(PJ15/LCD_B3/EVENTOUT) U1.B12(PD3/DFSDM1_CKOUT/SPI2_SCK/I2S2_CK/USART2_CTS/USART2_NSS/FMC_CLK/DCMI_D5/LCD_G7/EVENTOUT) U1.B16(PH15/TIM8_CH3N/FDCAN1_TXFD_MODE/FMC_D23/DCMI_D11/LCD_G4/EVENTOUT) U1.C1(PC15-OSC32_OUT/EVENTOUT) U1.C2(PC14-OSC32_IN/EVENTOUT) U1.C4(PE0/LPTIM1_ETR/TIM4_ETR/HRTIM_SCIN/LPTIM2_ETR/UART8_RX/FDCAN1_RXFD_MODE/SAI2_MCLK_A/FMC_NBL0/DCMI_D2/EVENTOUT) U1.C7(PK6/LCD_B7/EVENTOUT) U1.C8(PK3/LCD_B4/EVENTOUT) U1.C9(PG12/LPTIM1_IN1/HRTIM_EEV5/SPI6_MISO/USART6_RTS/USART6_DE/SPDIFRX1_IN2/LCD_B4/ETH_MII_TXD1/ETH_RMII_TXD1/FMC_NE4/LCD_B1/EVENTOUT) U1.D1(PE5/TRACED2/SAI1_CK2/DFSDM1_CKIN3/TIM15_CH1/SPI4_MISO/SAI1_SCK_A/SAI4_SCK_A/SAI4_CK2/FMC_A21/DCMI_D6/LCD_G0/EVENTOUT) U1.D2(PE4/TRACED1/SAI1_D2/DFSDM1_DATIN3/TIM15_CH1N/SPI4_NSS/SAI1_FS_A/SAI4_FS_A/SAI4_D2/FMC_A20/DCMI_D4/LCD_B0/EVENTOUT) U1.D3(PE3/TRACED0/TIM15_BKIN/SAI1_SD_B/SAI4_SD_B/FMC_A19/EVENTOUT) U1.D6(PG15/USART6_CTS/USART6_NSS/FMC_SDNCAS/DCMI_D13/EVENTOUT) U1.D7(PK7/LCD_DE/EVENTOUT) U1.D8(PG14/TRACED1/LPTIM1_ETR/SPI6_MOSI/USART6_TX/QUADSPI_BK2_IO3/ETH_MII_TXD1/ETH_RMII_TXD1/FMC_A25/LCD_B0/EVENTOUT) U1.D9(PG13/TRACED0/LPTIM1_OUT/HRTIM_EEV10/SPI6_SCK/USART6_CTS/USART6_NSS/ETH_MII_TXD0/ETH_RMII_TXD0/FMC_A24/LCD_R0/EVENTOUT) U1.D10(PJ14/LCD_B2/EVENTOUT) U1.D11(PJ12/TRGOUT/LCD_G3/LCD_B0/EVENTOUT) U1.D13(PD0/DFSDM1_CKIN6/SAI3_SCK_A/UART4_RX/FDCAN1_RX/FMC_D2/FMC_DA2/EVENTOUT) U1.E1(NC) U1.E2(PI9/UART4_RX/FDCAN1_RX/FMC_D30/LCD_VSYNC/EVENTOUT) U1.E4(PI8/EVENTOUT) U1.E5(PE6/TRACED3/TIM1_BKIN2/SAI1_D1/TIM15_CH2/SPI4_MOSI/SAI1_SD_A/SAI4_SD_A/SAI4_D1/SAI2_MCLK_B/TIM1_BKIN2_COMP12/FMC_A22/DCMI_D7/LCD_G1/EVENTOUT) U1.E10(PJ13/LCD_B4/LCD_B1/EVENTOUT) U1.E12(PD1/DFSDM1_DATIN6/SAI3_SD_A/UART4_TX/FDCAN1_TX/FMC_D3/FMC_DA3/EVENTOUT) U1.F1(NC1) U1.F3(PI10/FDCAN1_RXFD_MODE/ETH_MII_RX_ER/FMC_D31/LCD_HSYNC/EVENTOUT) U1.F4(PI11/LCD_G6/OTG_HS_ULPI_DIR/EVENTOUT) U1.F15(PG8/TIM8_ETR/SPI6_NSS/USART6_RTS/USART6_DE/SPDIFRX1_IN3/ETH_PPS_OUT/FMC_SDCLK/LCD_G7/EVENTOUT) U1.F16(PG7/HRTIM_CHE2/SAI1_MCLK_A/USART6_CK/FMC_INT/DCMI_D13/LCD_CLK/EVENTOUT) U1.G1(PF2/I2C2_SMBA/FMC_A2/EVENTOUT) U1.G2(NC2) U1.G14(PG5/TIM1_ETR/FMC_A15/FMC_BA1/EVENTOUT) U1.H1(PI12/LCD_HSYNC/EVENTOUT) U1.H2(PI13/LCD_VSYNC/EVENTOUT) U1.H3(PI14/LCD_CLK/EVENTOUT) U1.H4(PF3/FMC_A3/EVENTOUT) U1.H14(PG4/TIM1_BKIN2/TIM1_BKIN2_COMP12/FMC_A14/FMC_BA0/EVENTOUT) U1.H15(PG3/TIM8_BKIN2/TIM8_BKIN2_COMP12/FMC_A13/EVENTOUT) U1.H16(PG2/TIM8_BKIN/TIM8_BKIN_COMP12/FMC_A12/EVENTOUT) U1.H17(PK2/TIM1_BKIN/TIM8_BKIN/TIM8_BKIN_COMP12/TIM1_BKIN_COMP12/LCD_G7/EVENTOUT) U1.J4(PF5/FMC_A5/EVENTOUT) U1.J5(PF4/FMC_A4/EVENTOUT) U1.J14(PK0/TIM1_CH1N/TIM8_CH3/SPI5_SCK/LCD_G5/EVENTOUT) U1.K3(PF7/TIM17_CH1/SPI5_SCK/SAI1_MCLK_B/UART7_TX/SAI4_MCLK_B/QUADSPI_BK1_IO2/EVENTOUT) U1.K14(PJ11/TIM1_CH2/TIM8_CH2N/SPI5_MISO/LCD_G4/EVENTOUT) U1.K16(NC) U1.K17(NC) U1.L3(PF10/TIM16_BKIN/SAI1_D3/QUADSPI_CLK/SAI4_D3/DCMI_D11/LCD_DE/EVENTOUT) U1.L14(PJ10/TIM1_CH2N/TIM8_CH2/SPI5_MOSI/LCD_G3/EVENTOUT) U1.L16(NC) U1.L17(NC) U1.M4(PC3/CSLEEP/DFSDM1_DATIN1/SPI2_MOSI/I2S2_SDO/OTG_HS_ULPI_NXT/ETH_MII_TX_CLK/FMC_SDCKE0/EVENTOUT) U1.M14(PJ9/TIM1_CH3/TIM8_CH1N/UART8_RX/LCD_G2/EVENTOUT) U1.M16(NC) U1.M17(NC) U1.N2(PH2/LPTIM1_IN2/QUADSPI_BK2_IO0/SAI2_SCK_B/ETH_MII_CRS/FMC_SDCKE0/LCD_R0/EVENTOUT) U1.N6(PJ0/LCD_R7/LCD_R1/EVENTOUT) U1.N9(PE10/TIM1_CH2N/DFSDM1_DATIN4/UART7_CTS/QUADSPI_BK2_IO3/FMC_D7/FMC_DA7/EVENTOUT) U1.N14(PJ7/TRGIN/TIM8_CH2N/LCD_G0/EVENTOUT) U1.N15(PJ6/TIM8_CH2/LCD_R7/EVENTOUT) U1.N17(NC) U1.P2(PH3/QUADSPI_BK2_IO1/SAI2_MCLK_B/ETH_MII_COL/FMC_SDNE0/LCD_R1/EVENTOUT) U1.P3(PH4/I2C2_SCL/LCD_G5/OTG_HS_ULPI_NXT/LCD_G4/EVENTOUT) U1.P4(PH5/I2C2_SDA/SPI5_NSS/FMC_SDNWE/EVENTOUT) U1.P5(PI15/LCD_G2/LCD_R0/EVENTOUT) U1.P6(PJ1/LCD_R2/EVENTOUT) U1.P7(PF13/DFSDM1_DATIN6/I2C4_SMBA/FMC_A7/EVENTOUT) U1.P8(PF14/DFSDM1_CKIN6/I2C4_SCL/FMC_A8/EVENTOUT) U1.P9(PE9/TIM1_CH1/DFSDM1_CKOUT/UART7_RTS/UART7_DE/QUADSPI_BK2_IO2/FMC_D6/FMC_DA6/EVENTOUT) U1.P10(PE11/TIM1_CH2/DFSDM1_CKIN4/SPI4_NSS/SAI2_SD_B/FMC_D8/FMC_DA8/LCD_G3/EVENTOUT) U1.P13(PH10/TIM5_CH1/I2C4_SMBA/FMC_D18/DCMI_D1/LCD_R4/EVENTOUT) U1.P14(PH11/TIM5_CH2/I2C4_SCL/FMC_D19/DCMI_D2/LCD_R5/EVENTOUT) U1.P15(PD15/TIM4_CH4/SAI3_MCLK_A/UART8_RTS/UART8_DE/FMC_D1/FMC_DA1/EVENTOUT) U1.P16(PD14/TIM4_CH3/SAI3_MCLK_B/UART8_CTS/FMC_D0/FMC_DA0/EVENTOUT) U1.R1(PC2_C/CDSLEEP/DFSDM1_CKIN1/SPI2_MISO/I2S2_SDI/DFSDM1_CKOUT/OTG_HS_ULPI_DIR/ETH_MII_TXD2/FMC_SDNE0/EVENTOUT) U1.R2(PC3_C/CSLEEP/DFSDM1_DATIN1/SPI2_MOSI/I2S2_SDO/OTG_HS_ULPI_NXT/ETH_MII_TX_CLK/FMC_SDCKE0/EVENTOUT) U1.R3(PA6/TIM1_BKIN/TIM3_CH1/TIM8_BKIN/SPI1_MISO/I2S1_SDI/SPI6_MISO/TIM13_CH1/TIM8_BKIN_COMP12/MDIOS_MDC/TIM1_BKIN_COMP12/DCMI_PIXCLK/LCD_G2/EVENTOUT) U1.R5(PA7/TIM1_CH1N/TIM3_CH2/TIM8_CH1N/SPI1_MOSI/I2S1_SDO/SPI6_MOSI/TIM14_CH1/ETH_MII_RX_DV/ETH_RMII_CRS_DV/FMC_SDNWE/EVENTOUT) U1.R7(PF12/FMC_A6/EVENTOUT) U1.R9(PF15/I2C4_SDA/FMC_A9/EVENTOUT) U1.R10(PE12/TIM1_CH3N/DFSDM1_DATIN5/SPI4_SCK/SAI2_SCK_B/FMC_D9/FMC_DA9/COMP1_OUT/LCD_B4/EVENTOUT) U1.R11(PE15/TIM1_BKIN/FMC_D12/FMC_DA12/TIM1_BKIN_COMP12/COMP_TIM1_BKIN/LCD_R7/EVENTOUT) U1.R12(PJ5/LCD_R6/EVENTOUT) U1.R13(PH9/TIM12_CH2/I2C3_SMBA/FMC_D17/DCMI_D0/LCD_R3/EVENTOUT) U1.R14(PH12/TIM5_CH3/I2C4_SDA/FMC_D20/DCMI_D3/LCD_R6/EVENTOUT) U1.R15(PD11/LPTIM2_IN2/I2C4_SMBA/USART3_CTS/USART3_NSS/QUADSPI_BK1_IO0/SAI2_SD_A/FMC_A16/EVENTOUT) U1.R17(PD13/LPTIM1_OUT/TIM4_CH2/I2C4_SDA/QUADSPI_BK1_IO3/SAI2_SCK_A/FMC_A18/EVENTOUT) U1.T2(PA1_C/TIM2_CH2/TIM5_CH2/LPTIM3_OUT/TIM15_CH1N/USART2_RTS/USART2_DE/UART4_RX/QUADSPI_BK1_IO3/SAI2_MCLK_B/ETH_MII_RX_CLK/ETH_RMII_REF_CLK/LCD_R2/EVENTOUT) U1.T4(PC4/DFSDM1_CKIN2/I2S1_MCK/SPDIFRX1_IN3/ETH_MII_RXD0/ETH_RMII_RXD0/FMC_SDNE0/EVENTOUT) U1.T6(PJ2/LCD_R3/EVENTOUT) U1.T8(PG0/FMC_A10/EVENTOUT) U1.T9(PE8/TIM1_CH1N/DFSDM1_CKIN2/UART7_TX/QUADSPI_BK2_IO1/FMC_D5/FMC_DA5/COMP2_OUT/EVENTOUT) U1.T10(PE13/TIM1_CH3/DFSDM1_CKIN5/SPI4_MISO/SAI2_FS_B/FMC_D10/FMC_DA10/COMP2_OUT/LCD_DE/EVENTOUT) U1.T11(PH6/TIM12_CH1/I2C2_SMBA/SPI5_SCK/ETH_MII_RXD2/FMC_SDNE1/DCMI_D8/EVENTOUT) U1.T13(PH8/TIM5_ETR/I2C3_SDA/FMC_D16/DCMI_HSYNC/LCD_R2/EVENTOUT) U1.T16(PD10/DFSDM1_CKOUT/SAI3_FS_B/USART3_CK/FDCAN2_TXFD_MODE/FMC_D15/FMC_DA15/LCD_B3/EVENTOUT) U1.U2(PA3/TIM2_CH4/TIM5_CH4/LPTIM5_OUT/TIM15_CH2/USART2_RX/LCD_B2/OTG_HS_ULPI_D0/ETH_MII_COL/LCD_B5/EVENTOUT) U1.U4(PC5/SAI1_D3/DFSDM1_DATIN2/SPDIFRX1_IN4/SAI4_D3/ETH_MII_RXD1/ETH_RMII_RXD1/FMC_SDCKE0/COMP1_OUT/EVENTOUT) U1.U6(PJ3/LCD_R4/EVENTOUT) U1.U7(PJ4/LCD_R5/EVENTOUT) U1.U8(PG1/FMC_A11/EVENTOUT) U1.U9(PE7/TIM1_ETR/DFSDM1_DATIN2/UART7_RX/QUADSPI_BK2_IO0/FMC_D4/FMC_DA4/EVENTOUT) U1.U13(PH7/I2C3_SCL/SPI5_MISO/ETH_MII_RXD3/FMC_SDCKE1/DCMI_D9/EVENTOUT) U1.U14(PB13/TIM1_CH1N/LPTIM2_OUT/SPI2_SCK/I2S2_CK/DFSDM1_CKIN1/USART3_CTS/USART3_NSS/FDCAN2_TX/OTG_HS_ULPI_D6/ETH_MII_TXD1/ETH_RMII_TXD1/UART5_TX/EVENTOUT) U1.U16(PD8/DFSDM1_CKIN3/SAI3_SCK_B/USART3_TX/SPDIFRX1_IN2/FMC_D13/FMC_DA13/EVENTOUT)

### Notes on the sheet
- ARM-7 STM32 H7
- AB
- 6 x UART 
  2 x I2C (BARO, IMU)
  4 x SPI (ESP, MAX74x, MMC, )
  8 x TIM(MOTOR OUT)
  1 x  SBUS
  8 x RC IN
- GH
- CD
- EF
- IJ

## Sheet 3 of 4: IO
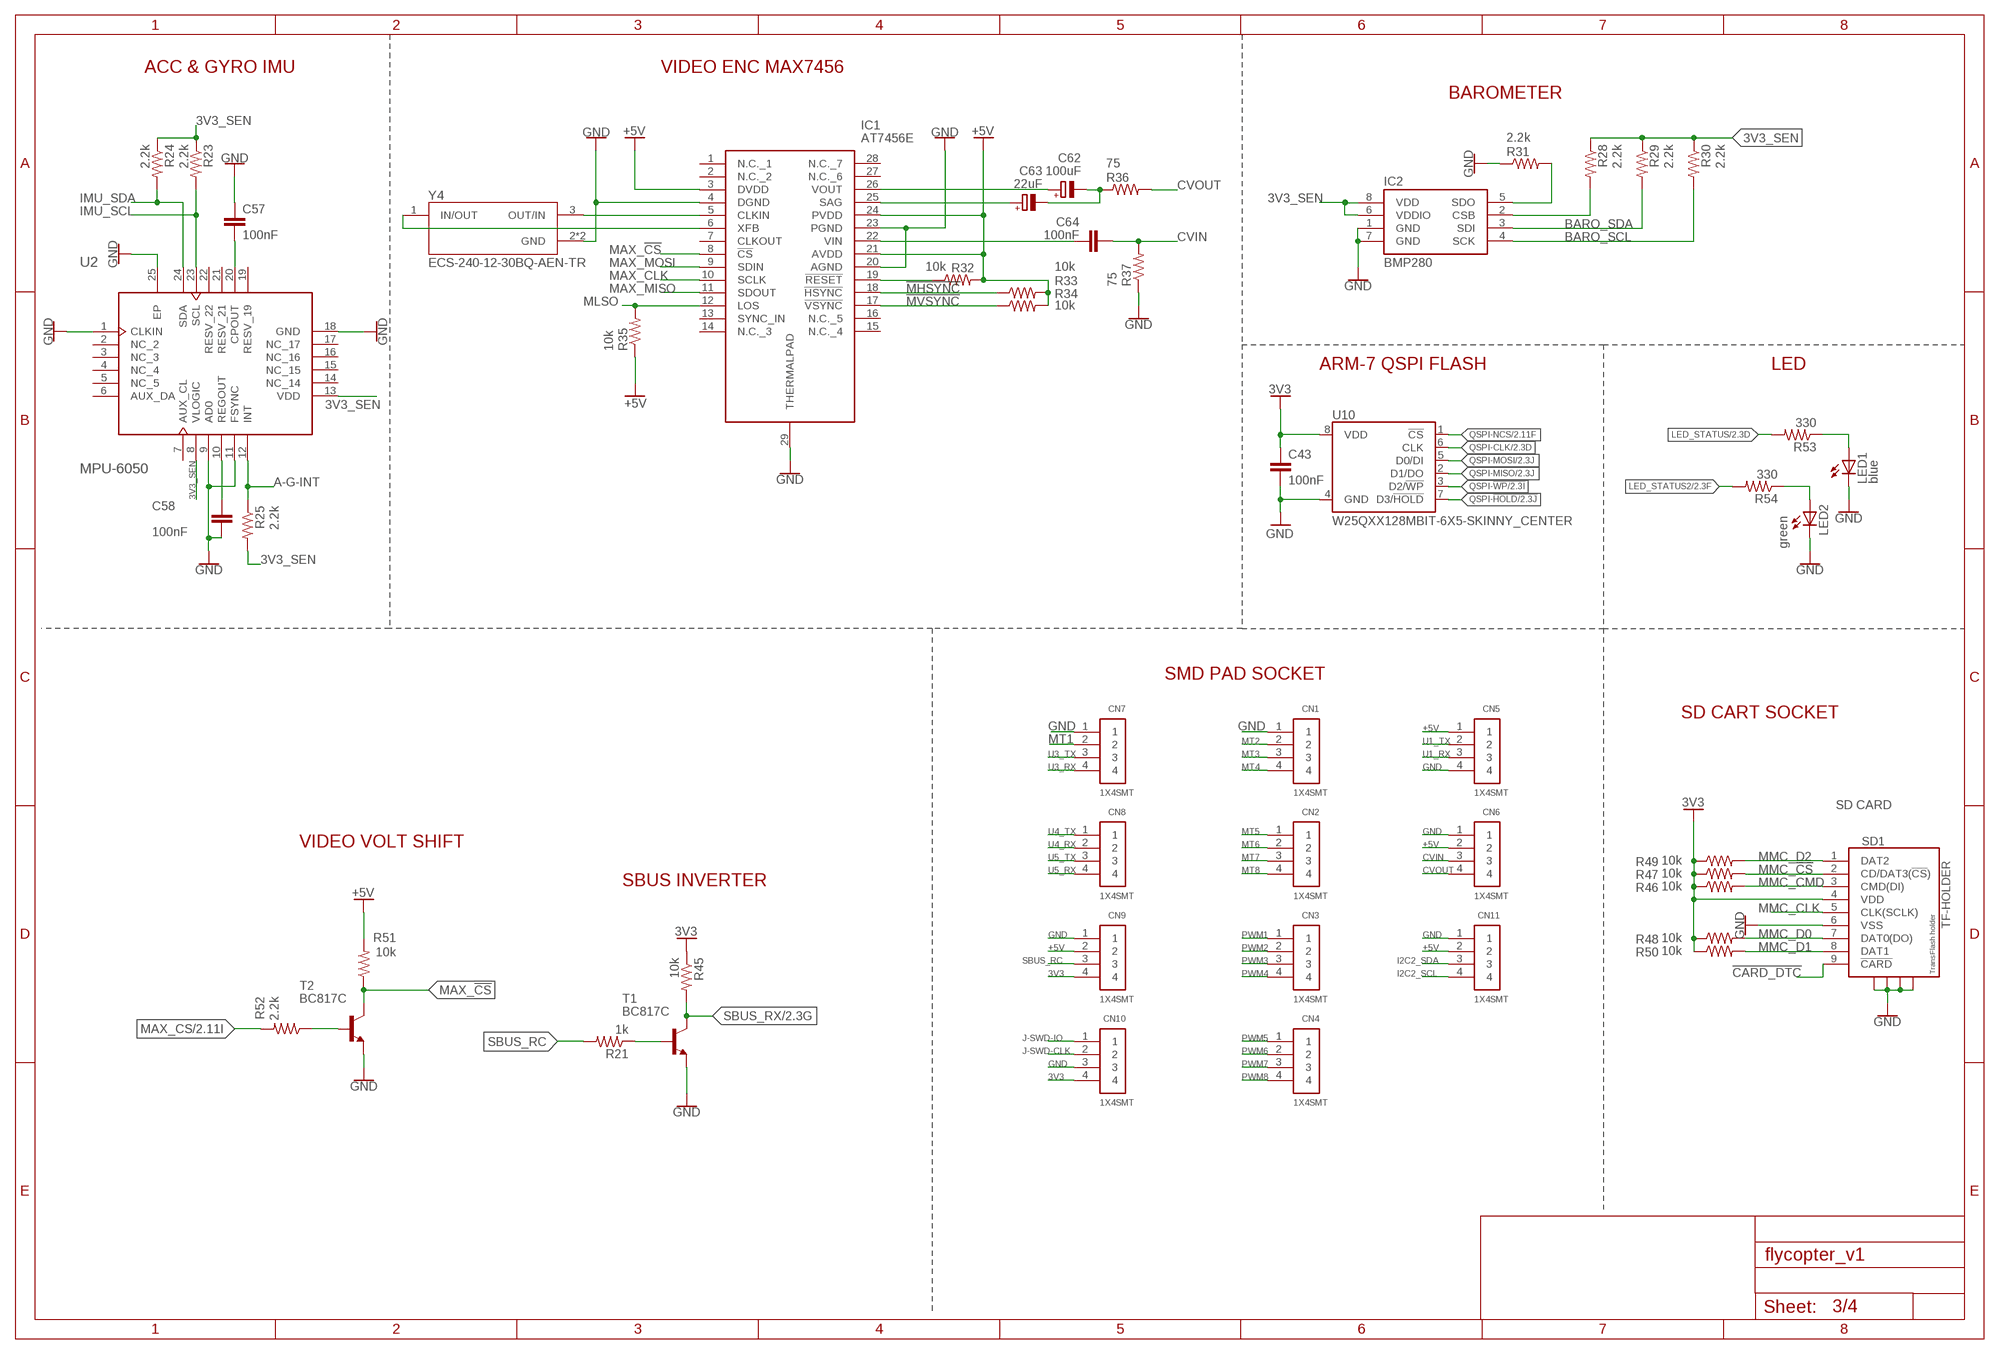
[diagram p6: schematic, sheet 3]

### Parts
C43  100nF  C-EUC0603K  [C0603K]
C57  100nF  C-EUC0603K  [C0603K]
C58  100nF  C-EUC0603K  [C0603K]
C62  100uF  CPOL-EUA/3216-18R  [A/3216-18R]
C63  22uF  CPOL-EUA/3216-18R  [A/3216-18R]
C64  100nF  C-EUC0603K  [C0603K]
CN1  1X4SMT  [1X4-SMT]
CN2  1X4SMT  [1X4-SMT]
CN3  1X4SMT  [1X4-SMT]
CN4  1X4SMT  [1X4-SMT]
CN5  1X4SMT  [1X4-SMT]
CN6  1X4SMT  [1X4-SMT]
CN7  1X4SMT  [1X4-SMT]
CN8  1X4SMT  [1X4-SMT]
CN9  1X4SMT  [1X4-SMT]
CN10  1X4SMT  [1X4-SMT]
CN11  1X4SMT  [1X4-SMT]
IC1  AT7456E  [SOP65P640X120-29N]
IC2  BMP280  [BMP280]
LED1  blue  LEDCHIPLED_0603  [CHIPLED_0603]
LED2  green  LEDCHIPLED_0603  [CHIPLED_0603]
R21  1k  R-US_R0402  [R0402]
R23  2.2k  R-US_R0402  [R0402]
R24  2.2k  R-US_R0402  [R0402]
R25  2.2k  R-US_R0402  [R0402]
R28  2.2k  R-US_R0402  [R0402]
R29  2.2k  R-US_R0402  [R0402]
R30  2.2k  R-US_R0402  [R0402]
R31  2.2k  R-US_R0402  [R0402]
R32  10k  R-US_R0402  [R0402]
R33  10k  R-US_R0402  [R0402]
R34  10k  R-US_R0402  [R0402]
R35  10k  R-US_R0402  [R0402]
R36  75  R-US_R0402  [R0402]
R37  75  R-US_R0402  [R0402]
R45  10k  R-US_R0402  [R0402]
R46  10k  R-US_R0402  [R0402]
R47  10k  R-US_R0402  [R0402]
R48  10k  R-US_R0402  [R0402]
R49  10k  R-US_R0402  [R0402]
R50  10k  R-US_R0402  [R0402]
R51  10k  R-US_R0402  [R0402]
R52  2.2k  R-US_R0402  [R0402]
R53  330  R-US_R0402  [R0402]
R54  330  R-US_R0402  [R0402]
SD1  TF-HOLDER  [TF-PULL]
T1  BC817C  BC817-16-NPN-SOT23-BEC  [SOT23-BEC]
T2  BC817C  BC817-16-NPN-SOT23-BEC  [SOT23-BEC]
U2  MPU-6050  [24-VFQFN]
U10  W25QXX128MBIT-6X5-SKINNY_CENTER  [WSON-8-6X5-SKINNY_CENTERPAD]
Y4  ECS-240-12-30BQ-AEN-TR  [XTAL_ECS-240-12-30BQ-AEN-TR]

### Nets
3V3 [power]: C43.1 CN9.4 CN10.4 R45.1 R46.1 R47.1 R48.1 R49.1 R50.1 SD1.4(VDD) U10.8(VDD) ; also sheet 1,2
3V3_SEN [power]: IC2.6(VDDIO) IC2.8(VDD) R23.1 R24.1 R25.2 R28.1 R29.1 R30.1 U2.8(VLOGIC) U2.13(VDD) ; also sheet 1
!CARD_DTC: SD1.9(!CARD) ; also sheet 2
!MHSYNC: IC1.18(!HSYNC) R33.1
!MVSYNC: IC1.17(!VSYNC) R34.1
+5V [power]: CN5.1 CN6.2 CN9.2 CN11.2 IC1.3(DVDD) IC1.21(AVDD) IC1.24(PVDD) R32.2 R33.2 R34.2 R35.1 R51.2 ; also sheet 1
A-G-INT: R25.1 U2.12(INT)
BARO_SCL: IC2.4(SCK) R30.2 ; also sheet 2
BARO_SDA: IC2.3(SDI) R29.2 ; also sheet 2
CVIN: C64.2 CN6.3 R37.2
CVOUT: CN6.4 R36.2
GND [power]: C43.2 C57.1 C58.2 CN1.1 CN5.4 CN6.1 CN7.1 CN9.1 CN10.3 CN11.1 IC1.4(DGND) IC1.20(AGND) IC1.23(PGND) IC1.29(THERMALPAD) IC2.1(GND) IC2.7(GND) LED1.C LED2.C R31.1 R37.1 SD1.6(VSS) SD1.S1 SD1.S2 SD1.S3 SD1.S4 T1.E T2.E U2.1(CLKIN) U2.9(AD0) U2.11(FSYNC) U2.18(GND) U2.25(EP) U10.4(GND) Y4.2(GND) Y4.4(GND) ; also sheet 1,2,4
I2C2_SCL: CN11.4 ; also sheet 2
I2C2_SDA: CN11.3 ; also sheet 2
IMU_SCL: R23.2 U2.23(SCL) ; also sheet 2
IMU_SDA: R24.2 U2.24(SDA) ; also sheet 2
J-SWD-CLK: CN10.2 ; also sheet 2
J-SWD-IO: CN10.1 ; also sheet 2
LED_STATUS: R53.2 ; also sheet 2
LED_STATUS2: R54.2 ; also sheet 2
MAX_!CS: IC1.8(!CS) R51.1 T2.C
MAX_CLK: IC1.10(SCLK) ; also sheet 2
MAX_CS: R52.2 ; also sheet 2
MAX_MISO: IC1.11(SDOUT) ; also sheet 2
MAX_MOSI: IC1.9(SDIN) ; also sheet 2
MLSO: IC1.12(LOS) R35.2
MMC_!CS: R47.2 SD1.2(CD/DAT3(!CS!)) ; also sheet 2
MMC_CLK: SD1.5(CLK(SCLK)) ; also sheet 2
MMC_CMD: R46.2 SD1.3(CMD(DI)) ; also sheet 2
MMC_D0: R48.2 SD1.7(DAT0(DO)) ; also sheet 2
MMC_D1: R50.2 SD1.8(DAT1) ; also sheet 2
MMC_D2: R49.2 SD1.1(DAT2) ; also sheet 2
MT1: CN7.2 ; also sheet 2
MT2: CN1.2 ; also sheet 2
MT3: CN1.3 ; also sheet 2
MT4: CN1.4 ; also sheet 2
MT5: CN2.1 ; also sheet 2
MT6: CN2.2 ; also sheet 2
MT7: CN2.3 ; also sheet 2
MT8: CN2.4 ; also sheet 2
N$17: R21.1 T1.B
N$23: LED1.A R53.1
N$24: LED2.A R54.1
N$37: R52.1 T2.B
N$51: IC1.19(!RESET) R32.1
N$53: C57.2 U2.20(CPOUT)
N$55: C58.1 U2.10(REGOUT)
N$56: C62.+ IC1.26(VOUT)
N$58: IC2.2(CSB) R28.2
N$59: IC2.5(SDO) R31.2
N$60: C63.+ IC1.25(SAG)
N$61: C62.- C63.- R36.1
N$62: C64.1 IC1.22(VIN)
N$68: IC1.6(XFB) Y4.1(IN/OUT)
N$69: IC1.5(CLKIN) Y4.3(OUT/IN)
PWM1: CN3.1 ; also sheet 2
PWM2: CN3.2 ; also sheet 2
PWM3: CN3.3 ; also sheet 2
PWM4: CN3.4 ; also sheet 2
PWM5: CN4.1 ; also sheet 2
PWM6: CN4.2 ; also sheet 2
PWM7: CN4.3 ; also sheet 2
PWM8: CN4.4 ; also sheet 2
QSPI-!HOLD: U10.7(D3/!HOLD!) ; also sheet 2
QSPI-!WP: U10.3(D2/!WP!) ; also sheet 2
QSPI-CLK: U10.6(CLK) ; also sheet 2
QSPI-MISO: U10.2(D1/DO) ; also sheet 2
QSPI-MOSI: U10.5(D0/DI) ; also sheet 2
QSPI-NCS: U10.1(!CS!) ; also sheet 2
SBUS_RC: CN9.3 R21.2
SBUS_RX: R45.2 T1.C ; also sheet 2
U1_RX: CN5.3 ; also sheet 2,4
U1_TX: CN5.2 ; also sheet 2,4
U3_RX: CN7.4 ; also sheet 2
U3_TX: CN7.3 ; also sheet 2
U4_RX: CN8.2 ; also sheet 2
U4_TX: CN8.1 ; also sheet 2
U5_RX: CN8.4 ; also sheet 2
U5_TX: CN8.3 ; also sheet 2
Unconnected: IC1.1(N.C._1) IC1.2(N.C._2) IC1.7(CLKOUT) IC1.13(SYNC_IN) IC1.14(N.C._3) IC1.15(N.C._4) IC1.16(N.C._5) IC1.27(N.C._6) IC1.28(N.C._7) U2.2(NC_2) U2.3(NC_3) U2.4(NC_4) U2.5(NC_5) U2.6(AUX_DA) U2.7(AUX_CL) U2.14(NC_14) U2.15(NC_15) U2.16(NC_16) U2.17(NC_17) U2.19(RESV_19) U2.21(RESV_21) U2.22(RESV_22)

### Notes on the sheet
- ACC & GYRO IMU | VIDEO ENC MAX7456
- BAROMETER
- ARM-7 QSPI FLASH | LED
- SMD PAD SOCKET
- SD CART SOCKET
- SD CARD
- VIDEO VOLT SHIFT
- SBUS INVERTER

## Sheet 4 of 4: RF BT ESP32
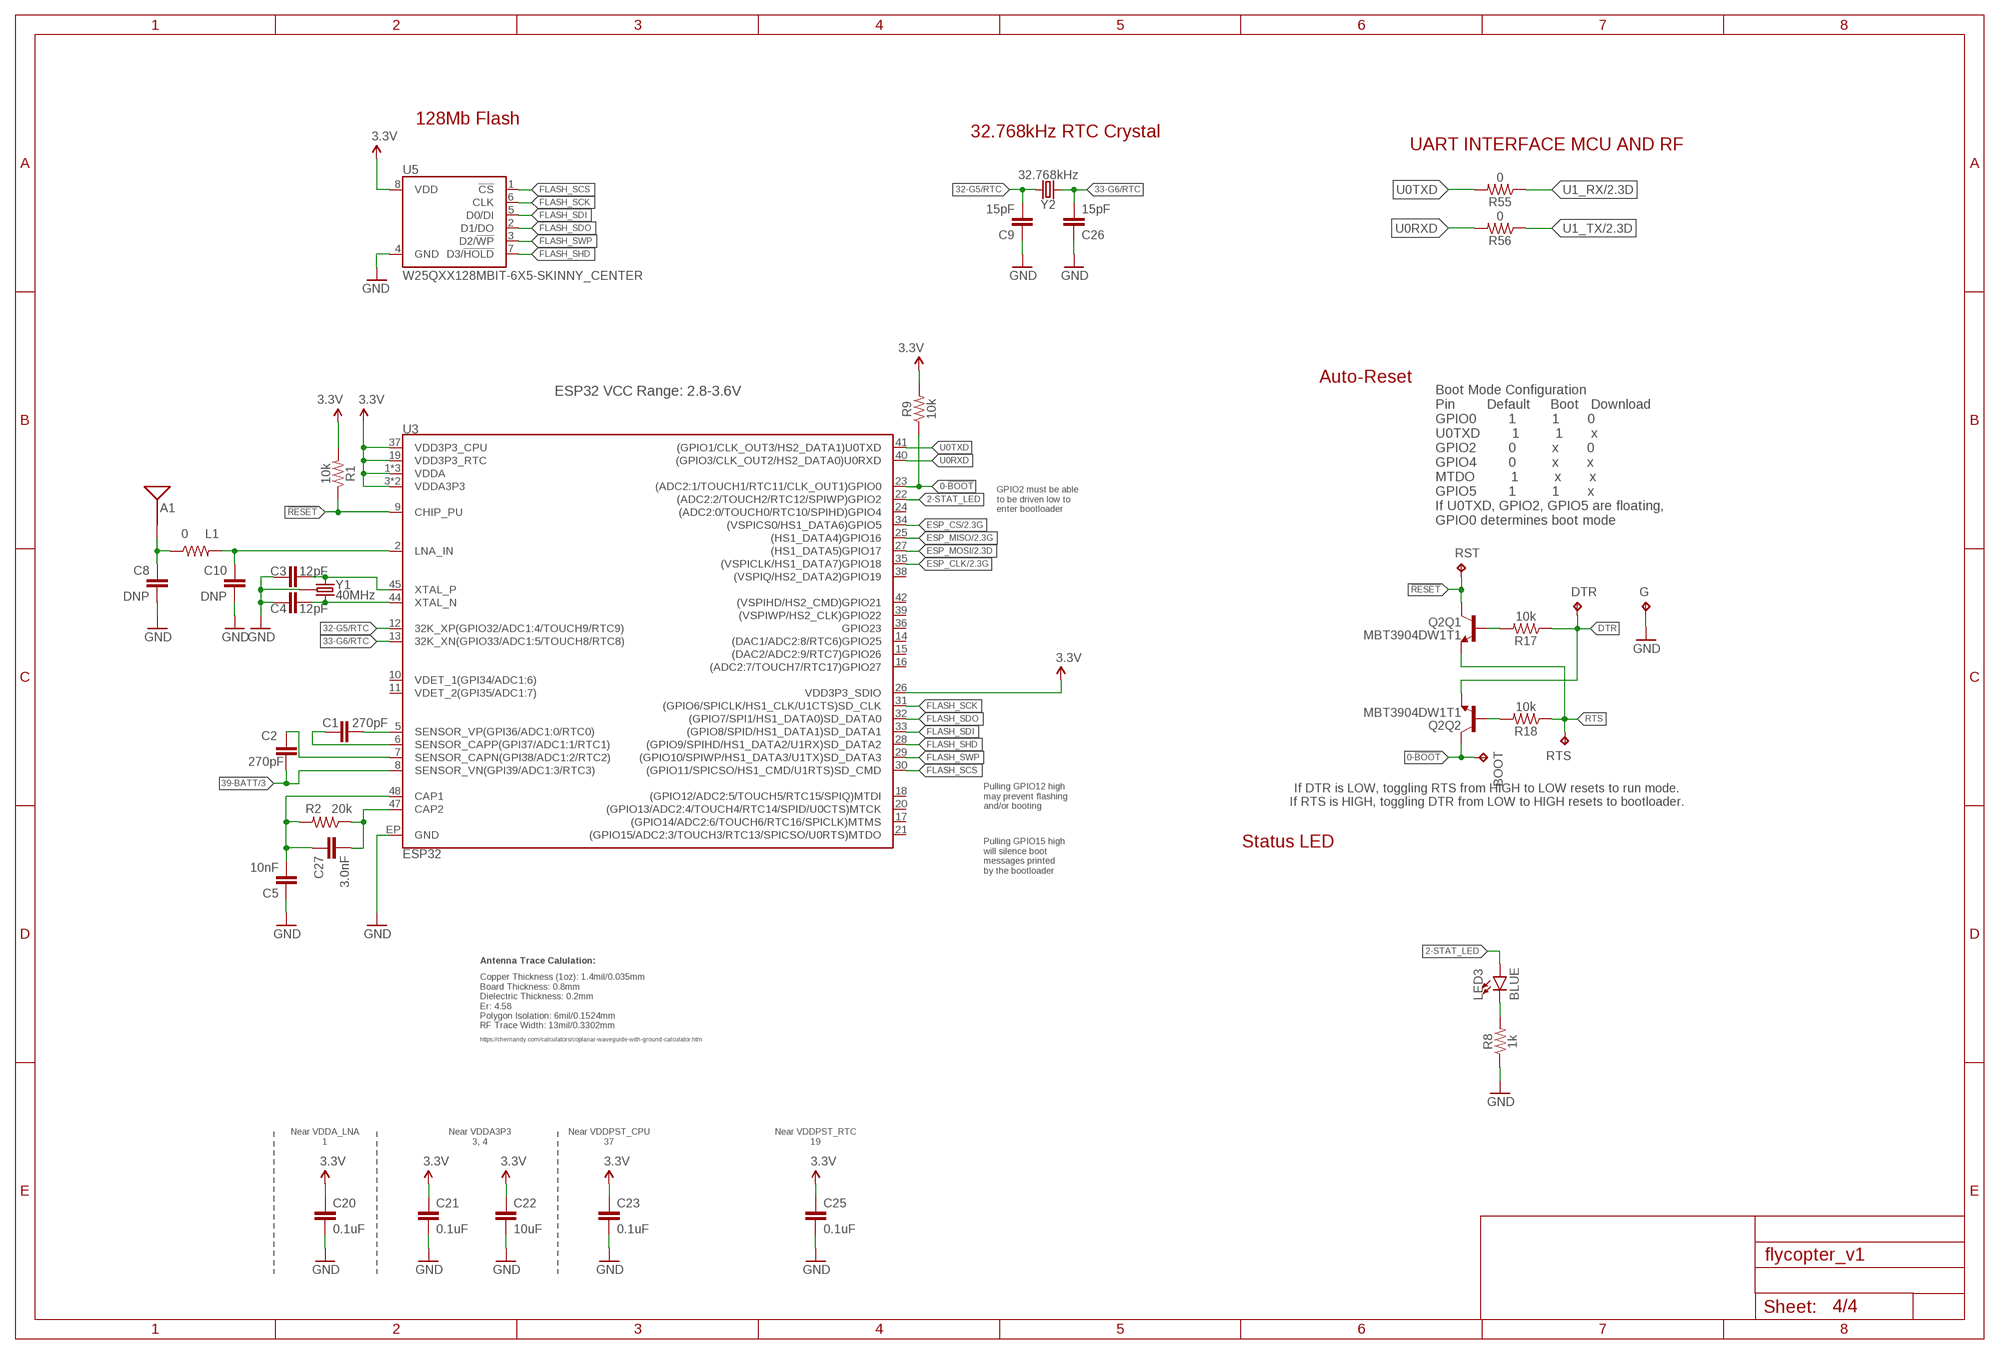
[diagram p7: schematic, sheet 4]

### Parts
A1  ANTENNA2.4GHZ-8.0X1.0MM  [ANT-2.4GHZ-8.0X1.0MM]
BOOT  TPTP06R  [TP06R]
C1  270pF  270PF-0402T-50V-5%  [0402-TIGHT]
C2  270pF  270PF-0402T-50V-5%  [0402-TIGHT]
C3  12pF  12PF-0402T-50V-5%  [0402-TIGHT]
C4  12pF  12PF-0402T-50V-5%  [0402-TIGHT]
C5  10nF  10NF-0402T-25V-10%  [0402-TIGHT]
C8  DNP  CAP-0402-TIGHT  [0402-TIGHT]
C9  15pF  15PF-0402T-50V-5%  [0402-TIGHT]
C10  DNP  CAP-0402-TIGHT  [0402-TIGHT]
C20  0.1uF  0.1UF-0402T-16V-10%  [0402-TIGHT]
C21  0.1uF  0.1UF-0402T-16V-10%  [0402-TIGHT]
C22  10uF  10UF-0402T-6.3V-20%  [0402-TIGHT]
C23  0.1uF  0.1UF-0402T-16V-10%  [0402-TIGHT]
C25  0.1uF  0.1UF-0402T-16V-10%  [0402-TIGHT]
C26  15pF  15PF-0402T-50V-5%  [0402-TIGHT]
C27  3.0nF  3.0NF-0402T-50V-5%  [0402-TIGHT]
DTR  TPTP06R  [TP06R]
G  TPTP06R  [TP06R]
L1  0  0OHM-0402T-1/10W  [0402-TIGHT]
LED3  BLUE  LED-BLUE0603  [LED-0603]
Q2  MBT3904DW1T1  TRANS_NPN_DUAL-MBT3904DW1T1  [SC70-6]
R1  10k  10KOHM-0402T-1/16W-1%  [0402-TIGHT]
R2  20k  20KOHM-0402T-1/16W-1%  [0402-TIGHT]
R8  1k  1KOHM-0402T-1/16W-1%  [0402-TIGHT]
R9  10k  10KOHM-0402T-1/16W-1%  [0402-TIGHT]
R17  10k  10KOHM-0402T-1/16W-1%  [0402-TIGHT]
R18  10k  10KOHM-0402T-1/16W-1%  [0402-TIGHT]
R55  0  10KOHM-0402T-1/16W-1%  [0402-TIGHT]
R56  0  10KOHM-0402T-1/16W-1%  [0402-TIGHT]
RST  TPTP06R  [TP06R]
RTS  TPTP06R  [TP06R]
U3  ESP32  [QFN48-0.4MM]
U5  W25QXX128MBIT-6X5-SKINNY_CENTER  [WSON-8-6X5-SKINNY_CENTERPAD]
Y1  40MHz  CRYSTAL-40MHZ-SMD-2X2.5MM  [CRYSTAL-SMD-2X2.5MM]
Y2  32.768kHz  CRYSTAL-32.768KHZSMD-3.2X1.5  [CRYSTAL-SMD-3.2X1.5MM]

### Nets
0-!BOOT!: BOOT.TP Q2.6(Q2:C) R9.1 U3.23((ADC2:1/TOUCH1/RTC11/CLK_OUT1)GPIO0)
2-STAT_LED: LED3.A U3.22((ADC2:2/TOUCH2/RTC12/SPIWP)GPIO2)
3.3V [power]: C20.1 C21.1 C22.1 C23.1 C25.1 R1.2 R9.2 U3.1(VDDA) U3.3(VDDA3P3) U3.4(VDDA3P3) U3.19(VDD3P3_RTC) U3.26(VDD3P3_SDIO) U3.37(VDD3P3_CPU) U3.43(VDDA) U3.46(VDDA) U5.8(VDD) ; also sheet 1
32-G5/RTC: C9.2 U3.12(32K_XP(GPIO32/ADC1:4/TOUCH9/RTC9)) Y2.P$1
33-G6/RTC: C26.2 U3.13(32K_XN(GPIO33/ADC1:5/TOUCH8/RTC8)) Y2.P$2
36: C1.2 U3.5(SENSOR_VP(GPI36/ADC1:0/RTC0))
37: C1.1 U3.6(SENSOR_CAPP(GPI37/ADC1:1/RTC1))
38: C2.1 U3.7(SENSOR_CAPN(GPI38/ADC1:2/RTC2))
39-BATT/3: C2.2 U3.8(SENSOR_VN(GPI39/ADC1:3/RTC3))
!RESET: Q2.3(Q1:C) R1.1 RST.TP U3.9(CHIP_PU)
CAP_10N: C5.2 C27.1 R2.2 U3.48(CAP1)
DTR: DTR.TP Q2.1(Q2:E) R17.1
ESP_CLK: U3.35((VSPICLK/HS1_DATA7)GPIO18) ; also sheet 2
ESP_CS: U3.34((VSPICS0/HS1_DATA6)GPIO5) ; also sheet 2
ESP_MISO: U3.25((HS1_DATA4)GPIO16) ; also sheet 2
ESP_MOSI: U3.27((HS1_DATA5)GPIO17) ; also sheet 2
FLASH_SCK: U3.31((GPIO6/SPICLK/HS1_CLK/U1CTS)SD_CLK) U5.6(CLK)
FLASH_SCS: U3.30((GPIO11/SPICSO/HS1_CMD/U1RTS)SD_CMD) U5.1(!CS!)
FLASH_SDI: U3.33((GPIO8/SPID/HS1_DATA1)SD_DATA1) U5.5(D0/DI)
FLASH_SDO: U3.32((GPIO7/SPI1/HS1_DATA0)SD_DATA0) U5.2(D1/DO)
FLASH_SHD: U3.28((GPIO9/SPIHD/HS1_DATA2/U1RX)SD_DATA2) U5.7(D3/!HOLD!)
FLASH_SWP: U3.29((GPIO10/SPIWP/HS1_DATA3/U1TX)SD_DATA3) U5.3(D2/!WP!)
GND [power]: C3.1 C4.1 C5.1 C8.2 C9.1 C10.2 C20.2 C21.2 C22.2 C23.2 C25.2 C26.1 G.TP R8.1 U3.EP(GND) U5.4(GND) Y1.P2(GND) Y1.P4(GND) ; also sheet 1,2,3
N$27: Q2.5(Q1:B) R17.2
N$28: Q2.2(Q2:B) R18.2
N$29: C3.2 U3.45(XTAL_P) Y1.P1
N$30: C4.2 U3.44(XTAL_N) Y1.P3
N$31: LED3.C R8.2
N$32: C27.2 R2.1 U3.47(CAP2)
N$35: A1.FEED(SIGNAL) C8.1 L1.1
N$36: C10.1 L1.2 U3.2(LNA_IN)
RTS: Q2.4(Q1:E) R18.1 RTS.TP
U0RXD: R56.2 U3.40((GPIO3/CLK_OUT2/HS2_DATA0)U0RXD)
U0TXD: R55.2 U3.41((GPIO1/CLK_OUT3/HS2_DATA1)U0TXD)
U1_RX: R55.1 ; also sheet 2,3
U1_TX: R56.1 ; also sheet 2,3
Unconnected: U3.10(VDET_1(GPI34/ADC1:6)) U3.11(VDET_2(GPI35/ADC1:7)) U3.14((DAC1/ADC2:8/RTC6)GPIO25) U3.15((DAC2/ADC2:9/RTC7)GPIO26) U3.16((ADC2:7/TOUCH7/RTC17)GPIO27) U3.17((GPIO14/ADC2:6/TOUCH6/RTC16/SPICLK)MTMS) U3.18((GPIO12/ADC2:5/TOUCH5/RTC15/SPIQ)MTDI) U3.20((GPIO13/ADC2:4/TOUCH4/RTC14/SPID/U0CTS)MTCK) U3.21((GPIO15/ADC2:3/TOUCH3/RTC13/SPICSO/U0RTS)MTDO) U3.24((ADC2:0/TOUCH0/RTC10/SPIHD)GPIO4) U3.36(GPIO23) U3.38((VSPIQ/HS2_DATA2)GPIO19) U3.39((VSPIWP/HS2_CLK)GPIO22) U3.42((VSPIHD/HS2_CMD)GPIO21)

### Notes on the sheet
- 128Mb Flash
- 32.768kHz RTC Crystal
- UART INTERFACE MCU AND RF
- Auto-Reset
- ESP32 VCC Range: 2.8-3.6V
- GPIO2 must be able
  to be driven low to 
  enter bootloader
- Boot Mode Configuration
  Pin        Default     Boot   Download
  GPIO0        1         1       0
  U0TXD        1         1       x
  GPIO2        0         x       0
  GPIO4        0         x       x
  MTDO         1         x       x
  GPIO5        1         1       x
  If U0TXD, GPIO2, GPIO5 are floating, 
  GPIO0 determines boot mode
- If DTR is LOW, toggling RTS from HIGH to LOW resets to run mode.
  If RTS is HIGH, toggling DTR from LOW to HIGH resets to bootloader.
- Pulling GPIO12 high
  may prevent flashing
  and/or booting
- Status LED
- Pulling GPIO15 high
  will silence boot
  messages printed
  by the bootloader
- Antenna Trace Calulation:
- Copper Thickness (1oz): 1.4mil/0.035mm
  Board Thickness: 0.8mm
  Dielectric Thickness: 0.2mm
  Er: 4.58
  Polygon Isolation: 6mil/0.1524mm
  RF Trace Width: 13mil/0.3302mm
- https://chemandy.com/calculators/coplanar-waveguide-with-ground-calculator.htm
- Near VDDA_LNA
  1
- Near VDDA3P3
  3, 4
- Near VDDPST_CPU
  37
- Near VDDPST_RTC
  19

## Library data of the parts
A1 = SparkFun-RF:ANTENNA: Single-ended Antennae 2.4GHz and antennae with just one terminal. These are all chip antennae. 2.4GHz (WiFi/BT/ZigBee) Antennae ANT-2.4GHZ-6.5X2.2MM - 6.5 x 2.2 mm chip antenna. (SparkFun Product <https://www.sparkfun.com/products/144>) ANT-2.4GHZ8.0X1.0MM - 8.0 x 1.0 mm chip antenna. (Datasheet <http://www.mouser.com/ds/2/611/antenna_2500at44m0400-242425.pdf>) ANT-2.4GHZ9.5X2.0MM - 9.5 x 2.0 mm chip antenna. (SparkFun Product <https://www.sparkfun.com/products/9025>); PROD_ID: ANT-14377
BATT = wirepad:SMD5: SMD PAD
BOOT DAC DTR G RST RTS SBOOT SRST = BeagleBone_Blue_R3:TP: Test pad
C1 C2 = SparkFun-Capacitors:270PF: 270pF/0.27nF ceramic capacitors A capacitor is a passive two-terminal electrical component used to store electrical energy temporarily in an electric field.; PROD_ID: CAP-15129
C3 C4 = SparkFun-Capacitors:12PF: 12pF ceramic capacitors A capacitor is a passive two-terminal electrical component used to store electrical energy temporarily in an electric field.; PROD_ID: CAP-14665
C5 = SparkFun-Capacitors:10NF: 0.01uF/10nF/10,000pF ceramic capacitors A capacitor is a passive two-terminal electrical component used to store electrical energy temporarily in an electric field. CAP-09321; PROD_ID: CAP-14847
C6 C7 C11 C14 C15 C17 C18 C24 C28-C30 C33 C35-C40 C42-C46 C48 C49 C53 C55-C58 C60 C61 C64 C65 = rcl:C-EU: CAPACITOR, European symbol; SPICEPREFIX: C
C8 C10 = SparkFun-Capacitors:CAP
C9 C26 = SparkFun-Capacitors:15PF: 15pF ceramic capacitors A capacitor is a passive two-terminal electrical component used to store electrical energy temporarily in an electric field.; PROD_ID: CAP-13063
C12 C13 C16 C19 C31 C32 C34 C41 C47 C50-C52 C54 C59 C62 C63 C66 = resistor:CPOL-EU: POLARIZED CAPACITOR, European symbol
C20 C21 C23 C25 = SparkFun-Capacitors:0.1UF: 0.1µF ceramic capacitors A capacitor is a passive two-terminal electrical component used to store electrical energy temporarily in an electric field.; PROD_ID: CAP-12416
C22 = SparkFun-Capacitors:10UF: 10.0µF ceramic capacitors A capacitor is a passive two-terminal electrical component used to store electrical energy temporarily in an electric field.; PROD_ID: CAP-14848
C27 = SparkFun-Capacitors:3.0NF: 3.0nF (3nF, 3000pF) ceramic capacitors A capacitor is a passive two-terminal electrical component used to store electrical energy temporarily in an electric field.; PROD_ID: CAP-15130
CN1-CN11 = adafruit:1X4: 4-pin connector
D1 = 52101-101-REV-A_v16:DIODE_DIODE-: DIODE
D3 D5 = Diodes:SS54B: SURFACE MOUNT SCHOTTKY BARRIER RECTIFIERS Manufacturer's datasheet <http://www.pdc.com.tw/product/PDF/Short%20Form/SURFACE%20MOUNT%20DEVICE/SURFACE%20MOUNT%20SCHOTTKY%20BARRIER%20RECTIFIERS/SS52B~SS510B.pdf>; CREATED_BY: PCBLayout.com; MANUFACTURER: JCET; MPN: SS54B; PACKAGE: SMB
FB1-FB4 = SparkFun-Coils:FERRITE_BEAD: Ferrite Bead (blocks, cores, rings, chokes, etc.) Inductor with layers of ferrite used to suppress high frequencies. Often used to isolate high frequency noise. SparkFun Products: IOIO-OTG - V2.2 <https://www.sparkfun.com/products/13613> SparkFun SAMD21 Mini Breakout <https://www.sparkfun.com/products/13664> SparkFun 6 Degrees of Freedom Breakout - LSM6DS3 <https://www.sparkfun.com/products/13339> SparkFun SAMD21 Dev Breakout <https://www.sparkfun.com/products/13672>; PROD_ID: NDUC-14988
IC1 = AT7456E:AT7456E: Video Character Overlay Chip (OSD) Source: Datasheet <https://datasheet.lcsc.com/szlcsc/ZHONGKEWEI-AT7456E_C82351.pdf>; DESCRIPTION: Video Character Overlay Chip (OSD); HEIGHT: 1.2mm; MANUFACTURER_NAME: ICOF; MANUFACTURER_PART_NUMBER: AT7456E
IC2 = BeagleBone_Blue_R3:BMP280: BOSCH BMP280 Digital Pressure Sensor
IC3 = IC_Linear:MCP6001T: Low-Power Operational Amplifier Reference Datasheet <https://ww1.microchip.com/downloads/en/DeviceDoc/MCP6001-1R-1U-2-4-1-MHz-Low-Power-Op-Amp-DS20001733L.pdf>; CATEGORY: Amplifier; DESCRIPTION: Low-Power Operational Amplifier; MANUFACTURER: Microchip Technology; MPN: Generic; SERIES: MCP6001; SUB-CATEGORY: OpAmp
IC4 = st-microelectronics:LD3985: Ultra low drop and low noise BiCMOS voltage regulators Source: www.st.com LD3985.pdf
L1 = SparkFun-Resistors:0OHM: 0Ω resistor A resistor is a passive two-terminal electrical component that implements electrical resistance as a circuit element. Resistors act to reduce current flow, and, at the same time, act to lower voltage levels within circuits. - Wikipedia; PROD_ID: RES-14244
LED1 LED2 = adafruit:LED: LED OSRAM: - CHIPLED LG R971, LG N971, LY N971, LG Q971, LY Q971, LO R971, LY R971 LH N974, LH R974 LS Q976, LO Q976, LY Q976 LO Q996 - Hyper CHIPLED LW Q18S LB Q993, LB Q99A, LB R99A - SideLED LS A670, LO A670, LY A670, LG A670, LP A670 LB A673, LV A673, LT A673, LW A673 LH A674 LY A675 LS A676, LA A676, LO A676, LY A676, LW A676 LS A679, LY A679, LG A679 - Hyper Micro SIDELED® LS Y876, LA Y876, LO Y876, LY Y876 LT Y87S - SmartLED LW L88C, LW L88S LB L89C, LB L89S, LG L890 LS L89K, LO L89K, LY L89K LS L896, LA L896, LO L896, LY L896 - TOPLED LS T670, LO T670, LY T670, LG T670, LP T670 LSG T670, LSP T670, LSY T670, LOP T670, LYG T670 LG T671, LOG T671, LSG T671 LB T673, LV T673, LT T673, LW T673 LH T674 LS T676, LA T676, LO T676, LY T676, LB T676, LH T676, LSB T676, LW T676 LB T67C, LV T67C, LT T67C, LS T67K, LO T67K, LY T67K, LW E67C LS E67B, LA E67B, LO E67B, LY E67B, LB E67C, LV E67C, LT E67C LW T67C LS T679, LY T679, LG T679 LS T770, LO T770, LY T770, LG T770, LP T770 LB T773, LV T773, LT T773, LW T773 LH T774 LS E675, LA E675, LY E675, LS T675 LS T776, LA T776, LO T776, LY T776, LB T776 LHGB T686 LT T68C, LB T68C - Hyper Mini TOPLED® LB M676 - Mini TOPLED Santana® LG M470 LS M47K, LO M47K, LY M47K Source: http://www.osram.convergy.de/
LED3 = SparkFun-LED:LED-BLUE: Blue SMD LED Used in manufacturing of various products at SparkFun Packages: 0603 - SMD 0603 package [Product Link] <http://www.digikey.com/product-detail/en/SMLE12BC7TT86/511-1589-2-ND/1641808> 1206 - SMD1206 package [Product Link] <http://www.digikey.com/product-detail/en/lite-on-inc/LTST-C150TBKT/160-1643-1-ND/573584> SparkFun Products: ESP8266 Thing-Dev Board <https://www.sparkfun.com/products/13711> RedBoard <https://www.sparkfun.com/products/12757>; PROD_ID: DIO-08575
Q2 = SparkFun-DiscreteSemi:TRANS_NPN_DUAL: Dual NPN Transistors in Single Package The MBT3904W1 puts two general purpose 3904 NPN transistors in a single package. Datasheet <http://www.onsemi.com/pub_link/Collateral/MBT3904DW1T1-D.PDF> SparkFun Products: SparkFun ESP32 Thing <https://www.sparkfun.com/products/13907>; PROD_ID: TRANS-13337
R1 R9 R17 R18 = SparkFun-Resistors:10KOHM: 10kΩ resistor A resistor is a passive two-terminal electrical component that implements electrical resistance as a circuit element. Resistors act to reduce current flow, and, at the same time, act to lower voltage levels within circuits. - Wikipedia; PROD_ID: RES-14241
R2 = SparkFun-Resistors:20KOHM: 20kΩ resistor A resistor is a passive two-terminal electrical component that implements electrical resistance as a circuit element. Resistors act to reduce current flow, and, at the same time, act to lower voltage levels within circuits. - Wikipedia; PROD_ID: RES-15131
R3 R6 R7 R10-R16 R19-R54 R57 = rcl:R-US_: RESISTOR, American symbol; SPICEPREFIX: R
R8 = SparkFun-Resistors:1KOHM: 1kΩ resistor A resistor is a passive two-terminal electrical component that implements electrical resistance as a circuit element. Resistors act to reduce current flow, and, at the same time, act to lower voltage levels within circuits. - Wikipedia; PROD_ID: RES-14342
R55 R56 = SparkFun-Resistors:10KOHM: 10kΩ resistor A resistor is a passive two-terminal electrical component that implements electrical resistance as a circuit element. Resistors act to reduce current flow, and, at the same time, act to lower voltage levels within circuits. - Wikipedia; PROD_ID: RES-14241; VALUE: 10k
SD1 = sd-mmc:TF-HOLDER: TF / Micro SD socket is PUSH-PUSH type, the card can be pushed into and auto locked and pushed out by simply press the card. Surface Mounting type.
T1 T2 = transistor:*-NPN-: NPN Transistror BF959 corrected 2008.03.06
U1 = STM32H750XBH6:STM32H750XBH6: Check availability <https://pricing.snapeda.com/parts/STM32H750XBH6/STMicroelectronics/view-part?ref=eda>; AVAILABILITY: In Stock; DESCRIPTION: ARM® Cortex®-M7 STM32H7 Microcontroller IC 32-Bit Single-Core 480MHz 128KB (128K x 8) FLASH 240+25-TFBGA (14x14); MF: STMicroelectronics; MP: STM32H750XBH6; PACKAGE: TFBGA-265 STMicroelectronics; PRICE: None; PURCHASE-URL: https://pricing.snapeda.com/search/part/STM32H750XBH6/?ref=eda
U2 = Sensor:MPU-6050: IMU ACCEL/GYRO 3-AXIS I2C 24QFN Manufacturer's datasheet <https://store.invensense.com/datasheets/invensense/MPU-6050_DataSheet_V3%204.pdf>; CREATED_BY: PCBLayout.com; DIGIKEY_PART_NUMBER: 1428-1007-1-ND; MANUFACTURER: TDK InvenSense; MPN: MPU-6050; PACKAGE: 24-VFQFN
U3 = SparkFun-RF:ESP32: Espressif ESP32 WiFi-compatible SoC microcontroller. Bluetooth Low energy support (BLE, BT4.0, Bluetooth Smart) 28 GPIO pins Dual-core Tensilica LX6 microprocessor Hardware accelerated encryption (AES, SHA2, ECC, RSA-4096) 4MB Flash memory 520kB internal SRAM Datasheet <https://cdn.sparkfun.com/datasheets/IoT/esp32_datasheet_en.pdf> SparkFun Products: SparkFun ESP32 Thing <https://www.sparkfun.com/products/13907>; PROD_ID: IC-13338
U4 U6 = TPS62933PDRLR:TPS62933PDRLR: Check availability <https://pricing.snapeda.com/parts/TPS62933PDRLR/Texas%20Instruments/view-part?ref=eda>; AVAILABILITY: In Stock; DESCRIPTION: Buck Switching Regulator IC Positive Adjustable 0.8V 1 Output 3A SOT-583; MF: Texas Instruments; MP: TPS62933PDRLR; PACKAGE: None; PRICE: None; PURCHASE-URL: https://pricing.snapeda.com/search/part/TPS62933PDRLR/?ref=eda
U5 U10 = SparkFun-MicroMod:W25QXX; PROD_ID: IC-15107
U7 = SparkFun-IC-Power:V_REG_AP2112: AP2112 - 600mA CMOS LDO Regulator w/ Enable The AP2112 is CMOS process low dropout linear regulator with enable function, the regulator delivers a guaranteed 600mA (min.) continuous load current. Features Output Voltage Accuracy: ±1.5% Output Current: 600mA (Min.) Foldback Short Current Protection: 50mA Enable Function to Turn ON/OFF VOUT Low Dropout Voltage (3.3V): 250mV (Typ.) @IOUT=600mA Excellent Load Regulation: 0.2%/A (Typ.) Excellent Line Regulation: 0.02%/V (Typ.) Low Quiescent Current: 55μA (Typ.) Low Standby Current: 0.01μA (Typ.) Low Output Noise: 50μVRMS PSRR: 100Hz -65dB, 1kHz -65dB OTSD Protection Stable with 1.0μF Flexible Cap: Ceramic, Tantalum and Aluminum Electrolytic Operation Temperature Range: -40°C to 85°C ESD: MM 400V, HBM 4000V; PROD_ID: VREG-12457
U$5 U$9 = 0630CDMCCDS-4R7MC:0630CDMCCDS-4R7MC: Check availability <https://pricing.snapeda.com/parts/0630CDMCCDS-4R7MC/Sumida/view-part?ref=eda>; AVAILABILITY: In Stock; DESCRIPTION: 4.7 µH Shielded Molded Inductor 6.3 A 33mOhm Max Nonstandard; MF: Sumida; MP: 0630CDMCCDS-4R7MC; PACKAGE: Nonstandard Sumida; PRICE: None; PURCHASE-URL: https://pricing.snapeda.com/search/part/0630CDMCCDS-4R7MC/?ref=eda
USB1 = OPL_Connector:MICRO-USB-SMD-B-(10118193-0001LF): Seeed SKU 320010003 - SMD Micro USB-B MPN: 10118193-0001LF Important Notes: This part requires milling slots. Please make sure layer 46 Milling is included in the profile or outline layer when exporting Gerber files. Alternatively, you can use the built-in Seeed Fusion CAM file. Find it under Third-Party CAM files. This part has an overhanging portion. The edge of the PCB should be aligned with the line marked PCB Edge to be mounted correctly. Seeed Fusion PCBA OPL <https://www.seeedstudio.com/opl.html> Order PCB/PCBA Now <https://www.seeedstudio.com/fusion_pcb.html> www.seeedstudio.com; MPN: 10118193-0001LF
Y1 = SparkFun-Clocks:CRYSTAL-40MHZ: 40MHz Crystal w/ Ground Pin Digikey Example <https://www.digikey.com/product-detail/en/epson/FA-20H-40-0000MF10Z-K3/SER4045CT-ND/5175137> Frequency: 40MHz Frequency Stability: ±10ppm Frequency Tolerance: ±10ppm Load Capacitance: 10pF; PROD_ID: XTAL-15127; VALUE: 40MHZ
Y2 = SparkFun-Clocks:CRYSTAL-32.768KHZ: 32.768kHz Crystal Frequency: 32.768kHz Frequency Stability: ±20ppm Load Capacitance: 12.5pF (PTH-2X6 & SMD-3.2X1.5), 6pF (SMD-2X6) SparkFun Products: SparkFun BigTime Watch Kit <https://www.sparkfun.com/products/11734> SparkFun nRF52832 Breakout <https://www.sparkfun.com/products/13990> SparkFun Real Time Clock Module <https://www.sparkfun.com/products/12708>; PROD_ID: XTAL-13062
Y3 Y4 = ECS-240-12-30BQ-AEN-TR:ECS-240-12-30BQ-AEN-TR: The ECX-53BQ is a miniature SMD Crystal with a 3.2 x 5 mm footprint. AEC-Q200 Qualified. Check availability <https://pricing.snapeda.com/parts/ECS-240-12-30BQ-AEN-TR/ECS%20Inc./view-part?ref=eda>; AVAILABILITY: In Stock; DESCRIPTION: 24 MHz ±25ppm Crystal 12pF 30 Ohms 4-SMD, No Lead; MF: ECS Inc.; MP: ECS-240-12-30BQ-AEN-TR; PACKAGE: SMD-4 ECS International; PRICE: None; PURCHASE-URL: https://pricing.snapeda.com/search/part/ECS-240-12-30BQ-AEN-TR/?ref=eda